# EAGLE schematic haasoscope_pro_adc_fpga_board (EAGLE 9.6.2), part 1 of 3

## Sheet 1 of 16: Preinput 1
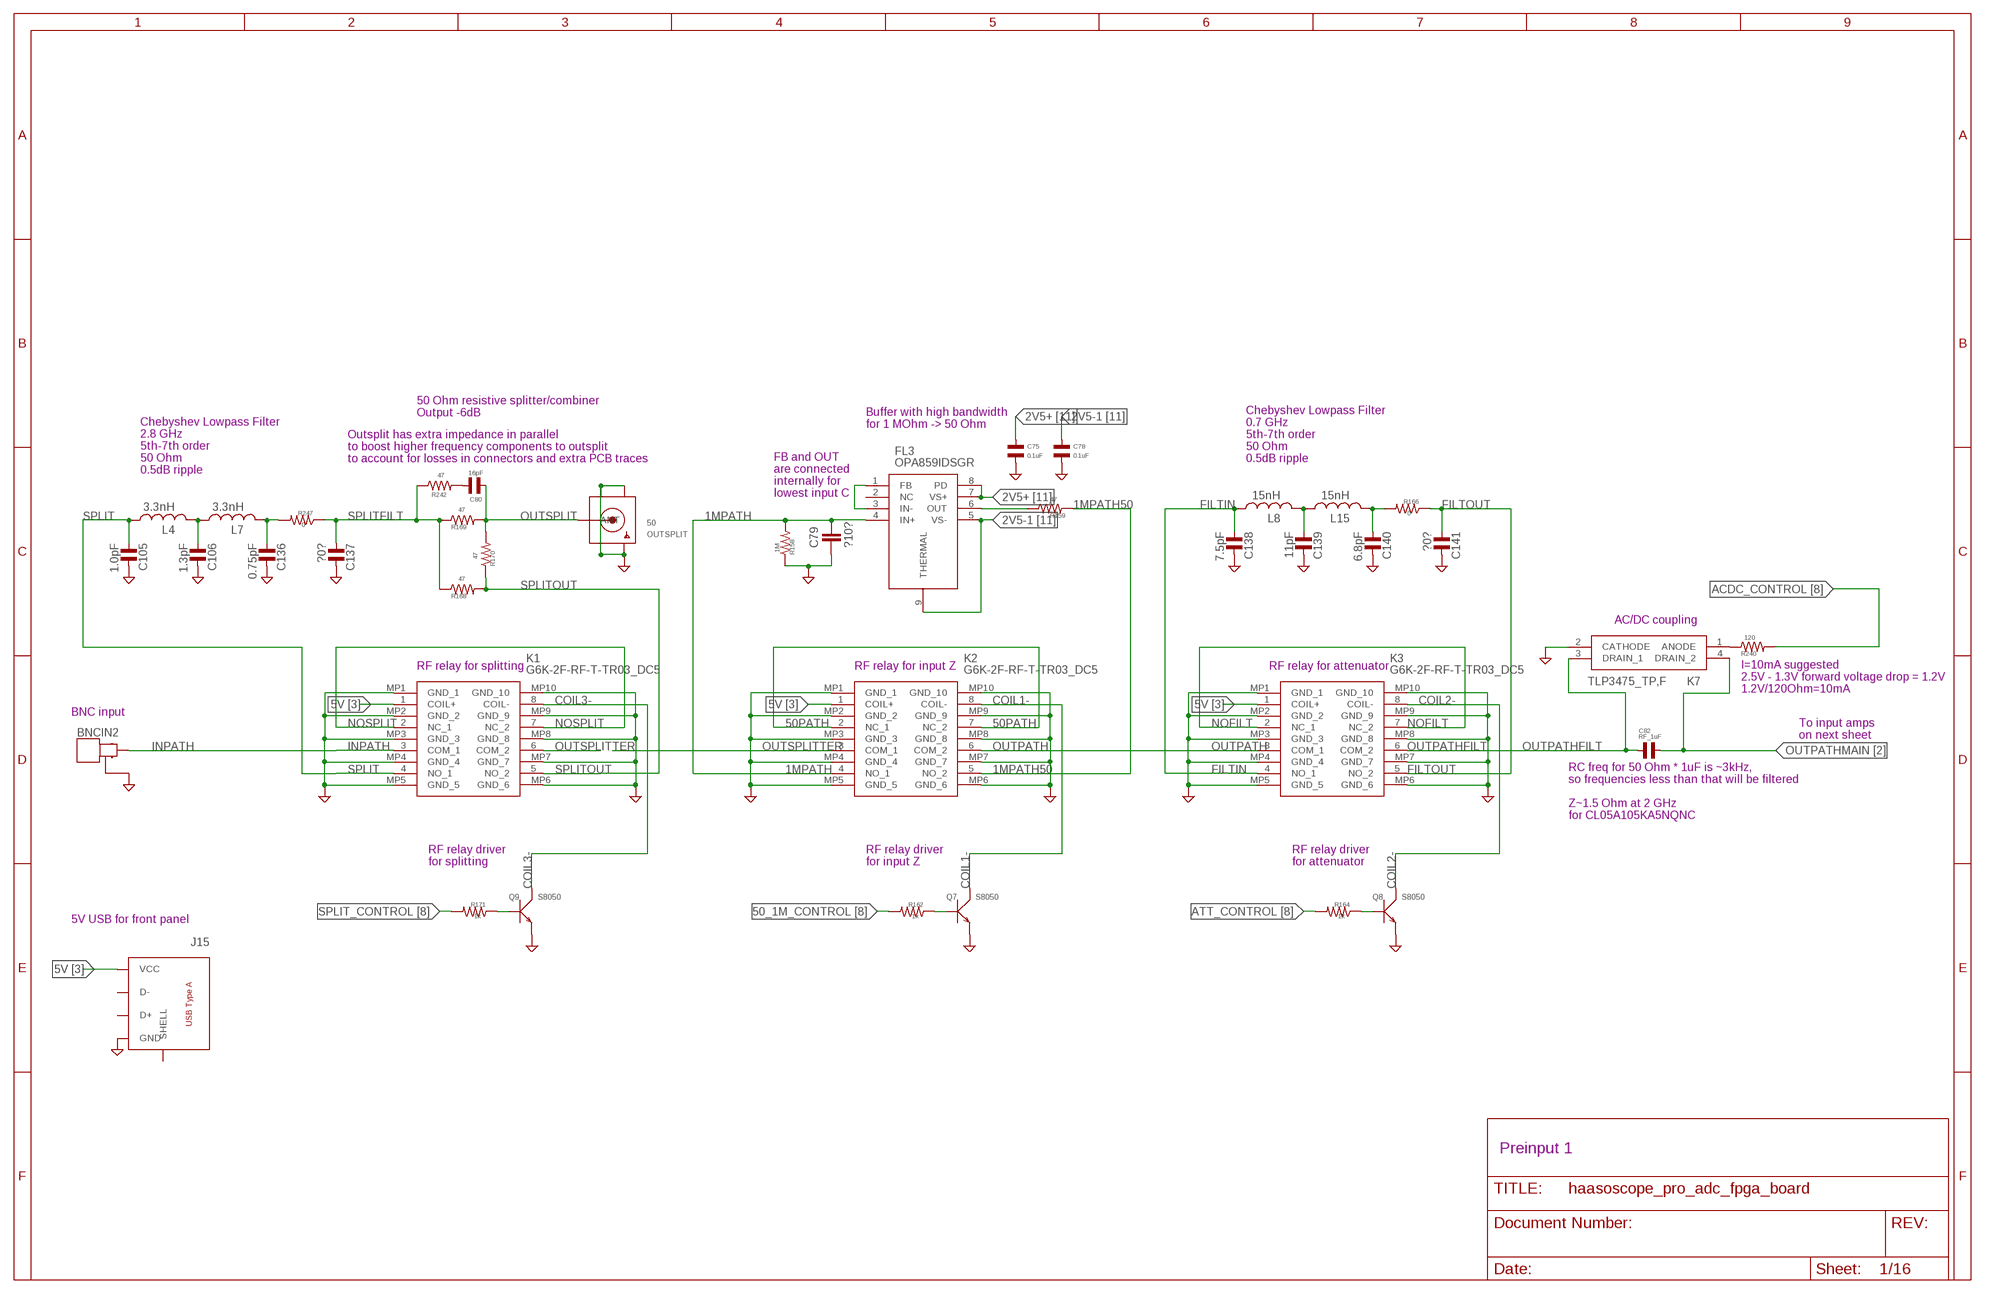
[diagram p0: schematic, sheet 1]

### Parts
BNCIN2  MOLEX_BNC_73100-0105  [MOLEX-BNC-73100-0105]
C75  0.1uF  CAPACITOR_NP_0402  [C0402]
C78  0.1uF  CAPACITOR_NP_0402  [C0402]
C79  ?10?  C-EUC0805  [C0805]
C80  16pF  CAPACITOR_NP_0402  [C0402]
C82  RF_1uF  CAPACITOR_NP_0402  [C0402]
C105  1.0pF  CAPACITOR_NP_0402  [C0402]
C106  1.3pF  CAPACITOR_NP_0402  [C0402]
C136  0.75pF  CAPACITOR_NP_0402  [C0402]
C137  ?0?  CAPACITOR_NP_0402  [C0402]
C138  7.5pF  CAPACITOR_NP_0402  [C0402]
C139  11pF  CAPACITOR_NP_0402  [C0402]
C140  6.8pF  CAPACITOR_NP_0402  [C0402]
C141  ?0?  CAPACITOR_NP_0402  [C0402]
FL3  OPA859IDSGR  [SON50P200X200X80-9N]
J15  test1  USB-TYPE-ATHT-RA  [USB-2.0-A-THT-RA-TE_AMP-292303-1]
K1  G6K-2F-RF-T-TR03_DC5  [G6K2FRFTTR03DC5]
K2  G6K-2F-RF-T-TR03_DC5  [G6K2FRFTTR03DC5]
K3  G6K-2F-RF-T-TR03_DC5  [G6K2FRFTTR03DC5]
K7  TLP3475_TP,F  [TLP3475TPF]
L4  3.3nH  INDUCTOR_0402_N  [RESC0402_N]
L7  3.3nH  INDUCTOR_0402_N  [RESC0402_N]
L8  15nH  INDUCTOR_0402_N  [RESC0402_N]
L15  15nH  INDUCTOR_0402_N  [RESC0402_N]
OUTSPLIT  50  SMACONNECTOR_EDGE  [SMA_EDGELAUNCH]
Q7  S8050  SMD-TRANSISTORS-NPN-25V-500MW-S8050(SOT-23)  [SOT-23]
Q8  S8050  SMD-TRANSISTORS-NPN-25V-500MW-S8050(SOT-23)  [SOT-23]
Q9  S8050  SMD-TRANSISTORS-NPN-25V-500MW-S8050(SOT-23)  [SOT-23]
R158  1M  RESISTOR_0402  [R0402]
R159  47  RESISTOR_0402  [R0402]
R162  1k  RESISTOR_0402  [R0402]
R164  1k  RESISTOR_0402  [R0402]
R166  0  RESISTOR_0402  [R0402]
R168  47  RESISTOR_0402  [R0402]
R169  47  RESISTOR_0402  [R0402]
R170  47  RESISTOR_0402  [R0402]
R171  1k  RESISTOR_0402  [R0402]
R240  120  RESISTOR_0402  [R0402]
R242  47  RESISTOR_0402  [R0402]
R247  0  RESISTOR_0402  [R0402]

### Nets
1MPATH: C79.2 FL3.4(IN+) K2.4(NO_1) R158.P$2
1MPATH50: K2.5(NO_2) R159.P$2
2V5+ [power]: C75.P$1 FL3.7(VS+) FL3.8(PD) ; also sheet 2,3,4,11
2V5-1 [power]: C78.P$1 FL3.5(VS-) FL3.9(THERMAL) ; also sheet 2,11
5V [power]: J15.P$1(VCC) K1.1(COIL+) K2.1(COIL+) K3.1(COIL+) ; also sheet 3,8,9,10,11,12,13,15
50_1M_CONTROL: R162.P$2 ; also sheet 8
50PATH: K2.2(NC_1) K2.7(NC_2)
ACDC_CONTROL: R240.P$2 ; also sheet 8
ATT_CONTROL: R164.P$2 ; also sheet 8
COIL1-: K2.8(COIL-) Q7.3(C)
COIL2-: K3.8(COIL-) Q8.3(C)
COIL3-: K1.8(COIL-) Q9.3(C)
FILTIN: C138.P$1 K3.4(NO_1) L8.1
FILTOUT: C141.P$1 K3.5(NO_2) R166.P$1
GND: BNCIN2.GND1(GND) BNCIN2.GND2(GND) C75.P$2 C78.P$2 C79.1 C105.P$2 C106.P$2 C136.P$2 C137.P$2 C138.P$2 C139.P$2 C140.P$2 C141.P$2 J15.P$4(GND) K1.MP1(GND_1) K1.MP2(GND_2) K1.MP3(GND_3) K1.MP4(GND_4) K1.MP5(GND_5) K1.MP6(GND_6) K1.MP7(GND_7) K1.MP8(GND_8) K1.MP9(GND_9) K1.MP10(GND_10) K2.MP1(GND_1) K2.MP2(GND_2) K2.MP3(GND_3) K2.MP4(GND_4) K2.MP5(GND_5) K2.MP6(GND_6) K2.MP7(GND_7) K2.MP8(GND_8) K2.MP9(GND_9) K2.MP10(GND_10) K3.MP1(GND_1) K3.MP2(GND_2) K3.MP3(GND_3) K3.MP4(GND_4) K3.MP5(GND_5) K3.MP6(GND_6) K3.MP7(GND_7) K3.MP8(GND_8) K3.MP9(GND_9) K3.MP10(GND_10) K7.2(CATHODE) OUTSPLIT.GND@1(GND4) OUTSPLIT.GND@2(GND3) OUTSPLIT.GND@3(GND2) OUTSPLIT.GND@4(GND1) Q7.2(E) Q8.2(E) Q9.2(E) R158.P$1 ; also sheet 2,3,4,5,6,7,8,9,10,11,12,13,14,15
INPATH: BNCIN2.SIGNAL K1.3(COM_1)
N$11: C139.P$1 L8.2 L15.1
N$50: FL3.6(OUT) R159.P$1
N$51: FL3.1(FB) FL3.3(IN-)
N$53: Q7.1(B) R162.P$1
N$55: Q8.1(B) R164.P$1
N$56: Q9.1(B) R171.P$1
N$64: K7.1(ANODE) R240.P$1
N$67: C80.P$1 R242.P$2
N$70: C140.P$1 L15.2 R166.P$2
N$81: C136.P$1 L7.2 R247.P$2
N$82: C106.P$1 L4.2 L7.1
NOFILT: K3.2(NC_1) K3.7(NC_2)
NOSPLIT: K1.2(NC_1) K1.7(NC_2)
OUTPATH: K2.6(COM_2) K3.3(COM_1)
OUTPATHFILT: C82.P$1 K3.6(COM_2) K7.3(DRAIN_1)
OUTPATHMAIN: C82.P$2 K7.4(DRAIN_2) ; also sheet 2
OUTSPLIT [critical]: C80.P$2 OUTSPLIT.P(ANT) R169.P$2 R170.P$2
OUTSPLITTER: K1.6(COM_2) K2.3(COM_1)
SPLIT: C105.P$1 K1.4(NO_1) L4.1
SPLIT_CONTROL: R171.P$2 ; also sheet 8
SPLITFILT: C137.P$1 R168.P$1 R169.P$1 R242.P$1 R247.P$1
SPLITOUT: K1.5(NO_2) R168.P$2 R170.P$1
Unconnected: FL3.2(NC) J15.P$2(D-) J15.P$3(D+) J15.S$1(SHELL) J15.S$2(SHELL)

### Notes on the sheet
- 50 Ohm resistive splitter/combiner
  Output -6dB
- Buffer with high bandwidth
  for 1 MOhm -> 50 Ohm
- Outsplit has extra impedance in parallel
  to boost higher frequency components to outsplit
  to account for losses in connectors and extra PCB traces
- Chebyshev Lowpass Filter
  0.7 GHz
  5th-7th order
  50 Ohm
  0.5dB ripple
- Chebyshev Lowpass Filter
  2.8 GHz
  5th-7th order
  50 Ohm
  0.5dB ripple
- FB and OUT
  are connected
  internally for
  lowest input C
- AC/DC coupling
- RF relay for splitting | RF relay for input Z | RF relay for attenuator
- I=10mA suggested
  2.5V - 1.3V forward voltage drop = 1.2V
  1.2V/120Ohm=10mA
- BNC input
- To input amps
  on next sheet
- RC freq for 50 Ohm * 1uF is ~3kHz,
  so frequencies less than that will be filtered
  
  Z~1.5 Ohm at 2 GHz
  for CL05A105KA5NQNC
- RF relay driver
  for splitting
- RF relay driver
  for input Z
- RF relay driver
  for attenuator
- 5V USB for front panel
- Preinput 1

## Sheet 2 of 16: Input amps 1
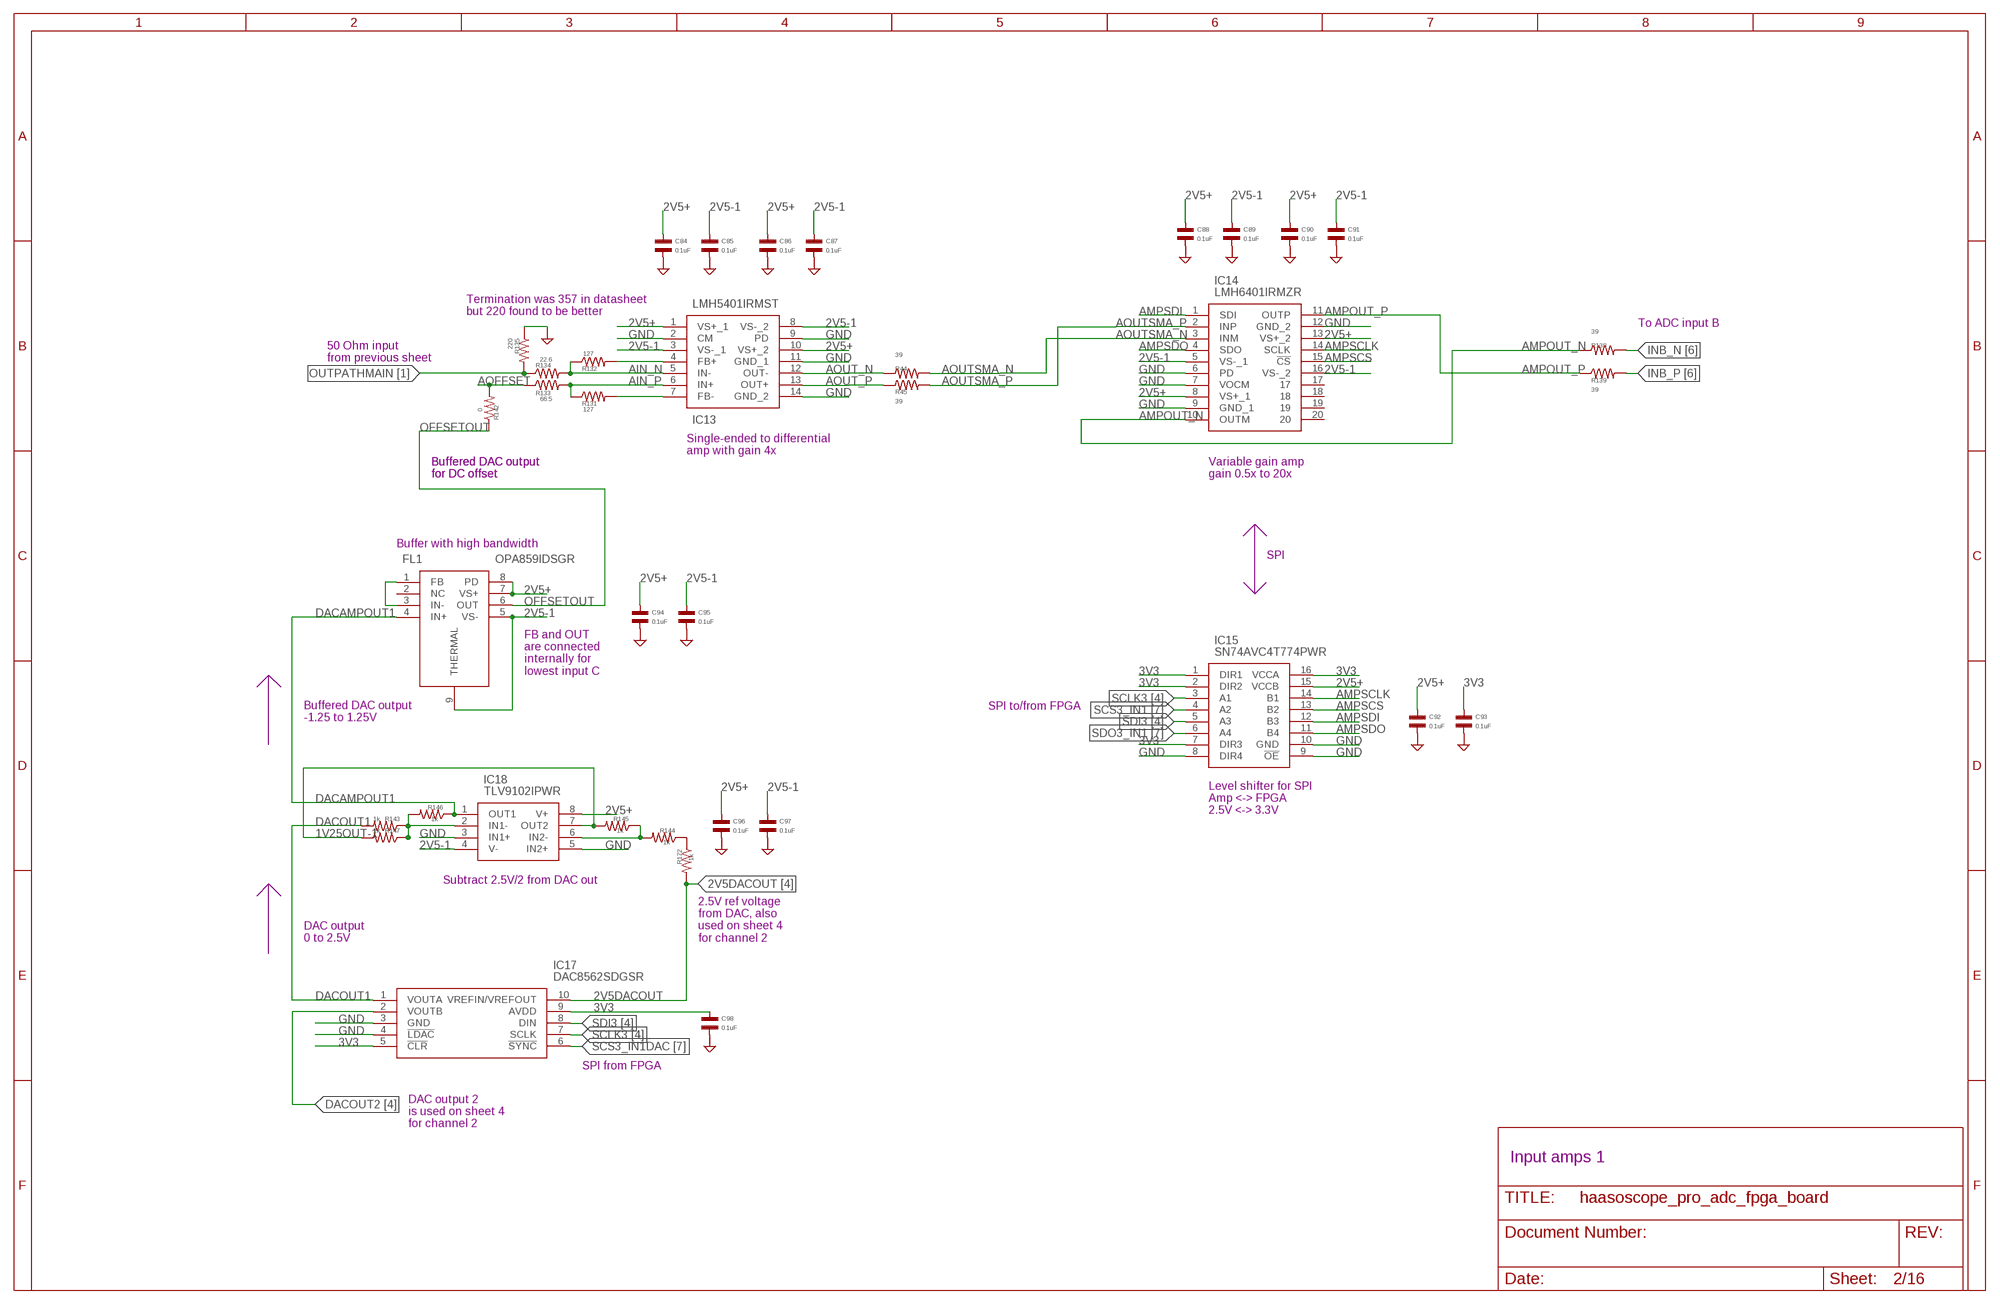
[diagram p1: schematic, sheet 2]

### Parts
C84  0.1uF  CAPACITOR_NP_0402  [C0402]
C85  0.1uF  CAPACITOR_NP_0402  [C0402]
C86  0.1uF  CAPACITOR_NP_0402  [C0402]
C87  0.1uF  CAPACITOR_NP_0402  [C0402]
C88  0.1uF  CAPACITOR_NP_0402  [C0402]
C89  0.1uF  CAPACITOR_NP_0402  [C0402]
C90  0.1uF  CAPACITOR_NP_0402  [C0402]
C91  0.1uF  CAPACITOR_NP_0402  [C0402]
C92  0.1uF  CAPACITOR_NP_0402  [C0402]
C93  0.1uF  CAPACITOR_NP_0402  [C0402]
C94  0.1uF  CAPACITOR_NP_0402  [C0402]
C95  0.1uF  CAPACITOR_NP_0402  [C0402]
C96  0.1uF  CAPACITOR_NP_0402  [C0402]
C97  0.1uF  CAPACITOR_NP_0402  [C0402]
C98  0.1uF  CAPACITOR_NP_0402  [C0402]
FL1  OPA859IDSGR  [SON50P200X200X80-9N]
IC13  LMH5401IRMST  [LMH5401IRMSR]
IC14  LMH6401IRMZR  [LMH6401IRMZR]
IC15  SN74AVC4T774PWR  [SOP65P640X120-16N]
IC17  DAC8562SDGSR  [SOP50P490X110-10N]
IC18  TLV9102IPWR  [SOP65P640X120-8N]
R44  39  RESISTOR_0402  [R0402]
R45  39  RESISTOR_0402  [R0402]
R131  127  RESISTOR_0402  [R0402]
R132  127  RESISTOR_0402  [R0402]
R133  66.5  RESISTOR_0402  [R0402]
R134  22.6  RESISTOR_0402  [R0402]
R135  220  RESISTOR_0402  [R0402]
R138  39  RESISTOR_0402  [R0402]
R139  39  RESISTOR_0402  [R0402]
R142  0  RESISTOR_0402  [R0402]
R143  1k  RESISTOR_0402  [R0402]
R144  1k  RESISTOR_0402  [R0402]
R145  1k  RESISTOR_0402  [R0402]
R146  1k  RESISTOR_0402  [R0402]
R147  1k  RESISTOR_0402  [R0402]
R172  1k  RESISTOR_0402  [R0402]

### Nets
1V25OUT-1: IC18.7(OUT2) R145.P$2 R147.P$2
2V5+ [power]: C84.P$1 C86.P$1 C88.P$1 C90.P$1 C92.P$1 C94.P$1 C96.P$1 FL1.7(VS+) FL1.8(PD) IC13.1(VS+_1) IC13.10(VS+_2) IC14.8(VS+_1) IC14.13(VS+_2) IC15.15(VCCB) IC18.8(V+) ; also sheet 1,3,4,11
2V5-1 [power]: C85.P$1 C87.P$1 C89.P$1 C91.P$1 C95.P$1 C97.P$1 FL1.5(VS-) FL1.9(THERMAL) IC13.3(VS-_1) IC13.8(VS-_2) IC14.5(VS-_1) IC14.16(VS-_2) IC18.4(V-) ; also sheet 1,11
2V5DACOUT: IC17.10(VREFIN/VREFOUT) R172.P$2 ; also sheet 4
3V3 [power]: C93.P$1 C98.P$1 IC15.1(DIR1) IC15.2(DIR2) IC15.7(DIR3) IC15.16(VCCA) IC17.5(!CLR) IC17.9(AVDD) ; also sheet 4,5,8,9,11,13,14,15
AIN_N [loosediffpair]: IC13.5(IN-) R132.P$1 R134.P$2
AIN_P [loosediffpair]: IC13.6(IN+) R131.P$1 R133.P$2
AMPOUT_N [loosediffpair]: IC14.10(OUTM) R138.P$1
AMPOUT_P [loosediffpair]: IC14.11(OUTP) R139.P$1
AMPSCLK: IC14.14(SCLK) IC15.14(B1)
AMPSCS: IC14.15(!CS) IC15.13(B2)
AMPSDI: IC14.1(SDI) IC15.12(B3)
AMPSDO: IC14.4(SDO) IC15.11(B4)
AOFFSET: R133.P$1 R142.P$2
AOUT_N [loosediffpair]: IC13.12(OUT-) R44.P$1
AOUT_P [loosediffpair]: IC13.13(OUT+) R45.P$1
AOUTSMA_N [loosediffpair]: IC14.3(INM) R44.P$2
AOUTSMA_P [loosediffpair]: IC14.2(INP) R45.P$2
DACAMPOUT1: FL1.4(IN+) IC18.1(OUT1) R146.P$1
DACOUT1: IC17.1(VOUTA) R143.P$2
DACOUT2: IC17.2(VOUTB) ; also sheet 4
GND: C84.P$2 C85.P$2 C86.P$2 C87.P$2 C88.P$2 C89.P$2 C90.P$2 C91.P$2 C92.P$2 C93.P$2 C94.P$2 C95.P$2 C96.P$2 C97.P$2 C98.P$2 IC13.2(CM) IC13.9(PD) IC13.11(GND_1) IC13.14(GND_2) IC14.6(PD) IC14.7(VOCM) IC14.9(GND_1) IC14.12(GND_2) IC15.8(DIR4) IC15.9(!OE) IC15.10(GND) IC17.3(GND) IC17.4(!LDAC) IC18.3(IN1+) IC18.5(IN2+) R135.P$1 ; also sheet 1,3,4,5,6,7,8,9,10,11,12,13,14,15
INB_N [looserdiffpair]: R138.P$2 ; also sheet 6
INB_P [looserdiffpair]: R139.P$2 ; also sheet 6
N$2: FL1.1(FB) FL1.3(IN-)
N$8: IC13.7(FB-) R131.P$2
N$9: IC13.4(FB+) R132.P$2
N$15: IC18.6(IN2-) R144.P$2 R145.P$1
N$16: IC18.2(IN1-) R143.P$1 R146.P$2 R147.P$1
N$39: R144.P$1 R172.P$1
OFFSETOUT: FL1.6(OUT) R142.P$1
OUTPATHMAIN: R134.P$1 R135.P$2 ; also sheet 1
SCLK3: IC15.3(A1) IC17.7(SCLK) ; also sheet 4,5,6,7,15
SCS3_IN1: IC15.4(A2) ; also sheet 7
SCS3_IN1DAC: IC17.6(!SYNC) ; also sheet 7
SDI3: IC15.5(A3) IC17.8(DIN) ; also sheet 4,5,6,7,15
SDO3_IN1: IC15.6(A4) ; also sheet 7
Unconnected: FL1.2(NC) IC14.17 IC14.18 IC14.19 IC14.20

### Notes on the sheet
- Termination was 357 in datasheet
  but 220 found to be better
- To ADC input B
- 50 Ohm input
  from previous sheet
- Single-ended to differential
  amp with gain 4x
- Buffered DAC output
  for DC offset
- Buffered DAC output
  for DC offset
- Variable gain amp
  gain 0.5x to 20x
- Buffer with high bandwidth
- SPI
- FB and OUT
  are connected
  internally for
  lowest input C
- SPI to/from FPGA
- Buffered DAC output
  -1.25 to 1.25V
- Level shifter for SPI
  Amp <-> FPGA
  2.5V <-> 3.3V
- Subtract 2.5V/2 from DAC out
- DAC output
  0 to 2.5V
- 2.5V ref voltage
  from DAC, also
  used on sheet 4
  for channel 2
- SPI from FPGA
- DAC output 2
  is used on sheet 4
  for channel 2
- Input amps 1

## Sheet 3 of 16: Preinput 2
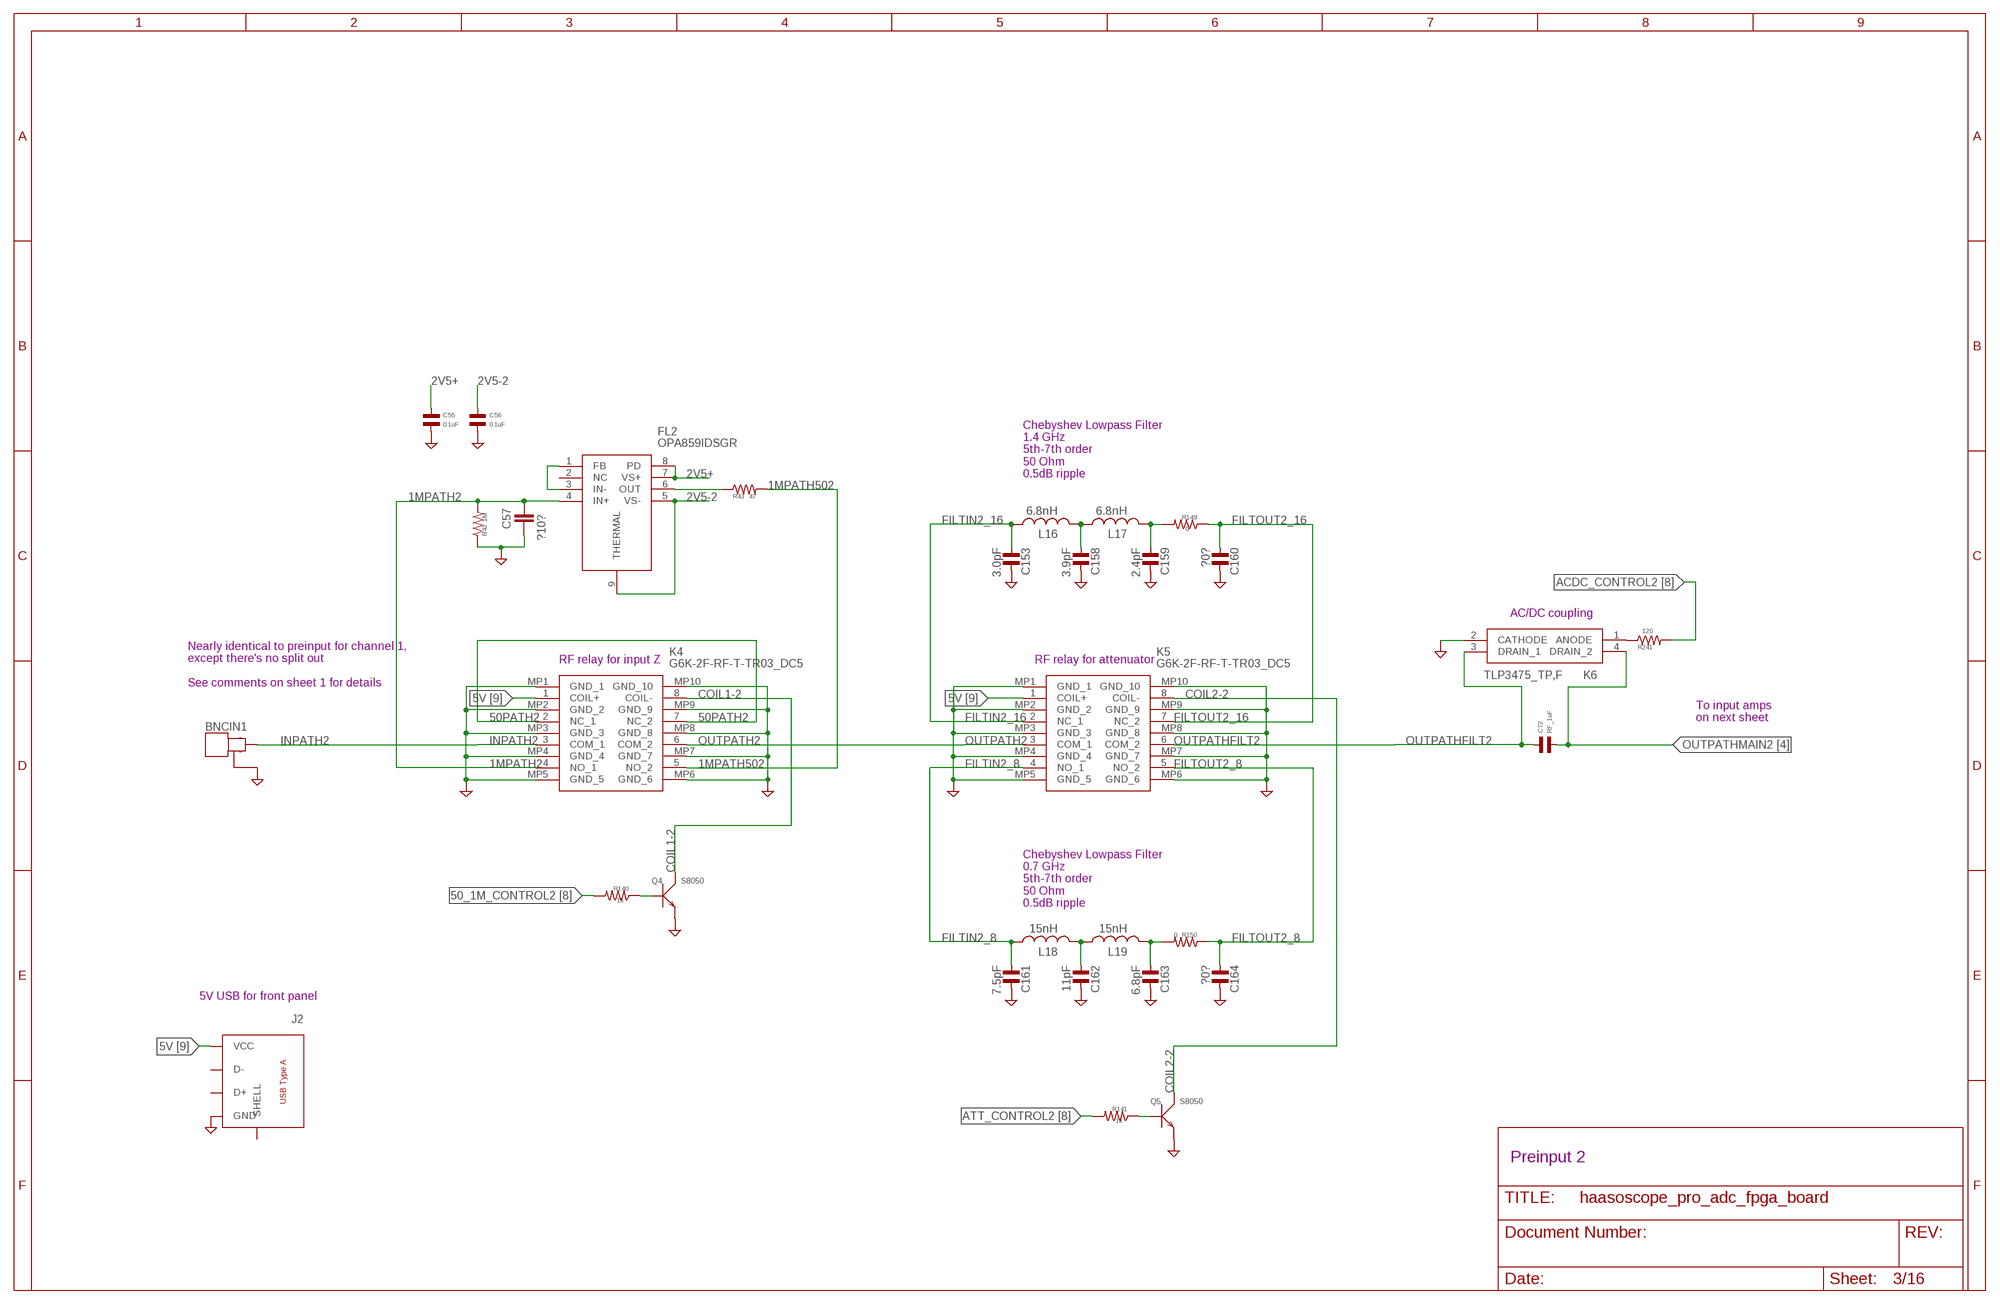
[diagram p2: schematic, sheet 3]

### Parts
BNCIN1  MOLEX_BNC_73100-0105  [MOLEX-BNC-73100-0105]
C55  0.1uF  CAPACITOR_NP_0402  [C0402]
C56  0.1uF  CAPACITOR_NP_0402  [C0402]
C57  ?10?  C-EUC0805  [C0805]
C72  RF_1uF  CAPACITOR_NP_0402  [C0402]
C153  3.0pF  CAPACITOR_NP_0402  [C0402]
C158  3.9pF  CAPACITOR_NP_0402  [C0402]
C159  2.4pF  CAPACITOR_NP_0402  [C0402]
C160  ?0?  CAPACITOR_NP_0402  [C0402]
C161  7.5pF  CAPACITOR_NP_0402  [C0402]
C162  11pF  CAPACITOR_NP_0402  [C0402]
C163  6.8pF  CAPACITOR_NP_0402  [C0402]
C164  ?0?  CAPACITOR_NP_0402  [C0402]
FL2  OPA859IDSGR  [SON50P200X200X80-9N]
J2  test1  USB-TYPE-ATHT-RA  [USB-2.0-A-THT-RA-TE_AMP-292303-1]
K4  G6K-2F-RF-T-TR03_DC5  [G6K2FRFTTR03DC5]
K5  G6K-2F-RF-T-TR03_DC5  [G6K2FRFTTR03DC5]
K6  TLP3475_TP,F  [TLP3475TPF]
L16  6.8nH  INDUCTOR_0402_N  [RESC0402_N]
L17  6.8nH  INDUCTOR_0402_N  [RESC0402_N]
L18  15nH  INDUCTOR_0402_N  [RESC0402_N]
L19  15nH  INDUCTOR_0402_N  [RESC0402_N]
Q4  S8050  SMD-TRANSISTORS-NPN-25V-500MW-S8050(SOT-23)  [SOT-23]
Q5  S8050  SMD-TRANSISTORS-NPN-25V-500MW-S8050(SOT-23)  [SOT-23]
R42  1M  RESISTOR_0402  [R0402]
R43  47  RESISTOR_0402  [R0402]
R140  1k  RESISTOR_0402  [R0402]
R141  1k  RESISTOR_0402  [R0402]
R149  0  RESISTOR_0402  [R0402]
R150  0  RESISTOR_0402  [R0402]
R241  120  RESISTOR_0402  [R0402]

### Nets
1MPATH2: C57.2 FL2.4(IN+) K4.4(NO_1) R42.P$2
1MPATH502: K4.5(NO_2) R43.P$2
2V5+ [power]: C55.P$1 FL2.7(VS+) FL2.8(PD) ; also sheet 1,2,4,11
2V5-2 [power]: C56.P$1 FL2.5(VS-) FL2.9(THERMAL) ; also sheet 4,11
5V [power]: J2.P$1(VCC) K4.1(COIL+) K5.1(COIL+) ; also sheet 1,8,9,10,11,12,13,15
50_1M_CONTROL2: R140.P$2 ; also sheet 8
50PATH2: K4.2(NC_1) K4.7(NC_2)
ACDC_CONTROL2: R241.P$2 ; also sheet 8
ATT_CONTROL2: R141.P$2 ; also sheet 8
COIL1-2: K4.8(COIL-) Q4.3(C)
COIL2-2: K5.8(COIL-) Q5.3(C)
FILTIN2_8: C161.P$1 K5.4(NO_1) L18.1
FILTIN2_16: C153.P$1 K5.2(NC_1) L16.1
FILTOUT2_8: C164.P$1 K5.5(NO_2) R150.P$1
FILTOUT2_16: C160.P$1 K5.7(NC_2) R149.P$1
GND: BNCIN1.GND1(GND) BNCIN1.GND2(GND) C55.P$2 C56.P$2 C57.1 C153.P$2 C158.P$2 C159.P$2 C160.P$2 C161.P$2 C162.P$2 C163.P$2 C164.P$2 J2.P$4(GND) K4.MP1(GND_1) K4.MP2(GND_2) K4.MP3(GND_3) K4.MP4(GND_4) K4.MP5(GND_5) K4.MP6(GND_6) K4.MP7(GND_7) K4.MP8(GND_8) K4.MP9(GND_9) K4.MP10(GND_10) K5.MP1(GND_1) K5.MP2(GND_2) K5.MP3(GND_3) K5.MP4(GND_4) K5.MP5(GND_5) K5.MP6(GND_6) K5.MP7(GND_7) K5.MP8(GND_8) K5.MP9(GND_9) K5.MP10(GND_10) K6.2(CATHODE) Q4.2(E) Q5.2(E) R42.P$1 ; also sheet 1,2,4,5,6,7,8,9,10,11,12,13,14,15
INPATH2: BNCIN1.SIGNAL K4.3(COM_1)
N$7: FL2.6(OUT) R43.P$1
N$12: FL2.1(FB) FL2.3(IN-)
N$14: Q4.1(B) R140.P$1
N$18: Q5.1(B) R141.P$1
N$66: K6.1(ANODE) R241.P$1
N$73: C158.P$1 L16.2 L17.1
N$83: C159.P$1 L17.2 R149.P$2
N$88: C162.P$1 L18.2 L19.1
N$89: C163.P$1 L19.2 R150.P$2
OUTPATH2: K4.6(COM_2) K5.3(COM_1)
OUTPATHFILT2: C72.P$1 K5.6(COM_2) K6.3(DRAIN_1)
OUTPATHMAIN2: C72.P$2 K6.4(DRAIN_2) ; also sheet 4
Unconnected: FL2.2(NC) J2.P$2(D-) J2.P$3(D+) J2.S$1(SHELL) J2.S$2(SHELL)

### Notes on the sheet
- Chebyshev Lowpass Filter
  1.4 GHz
  5th-7th order
  50 Ohm
  0.5dB ripple
- AC/DC coupling
- RF relay for input Z | RF relay for attenuator
- Nearly identical to preinput for channel 1,
  except there's no split out
  
  See comments on sheet 1 for details
- To input amps
  on next sheet
- Chebyshev Lowpass Filter
  0.7 GHz
  5th-7th order
  50 Ohm
  0.5dB ripple
- 5V USB for front panel
- Preinput 2

## Sheet 4 of 16: Input amps 2
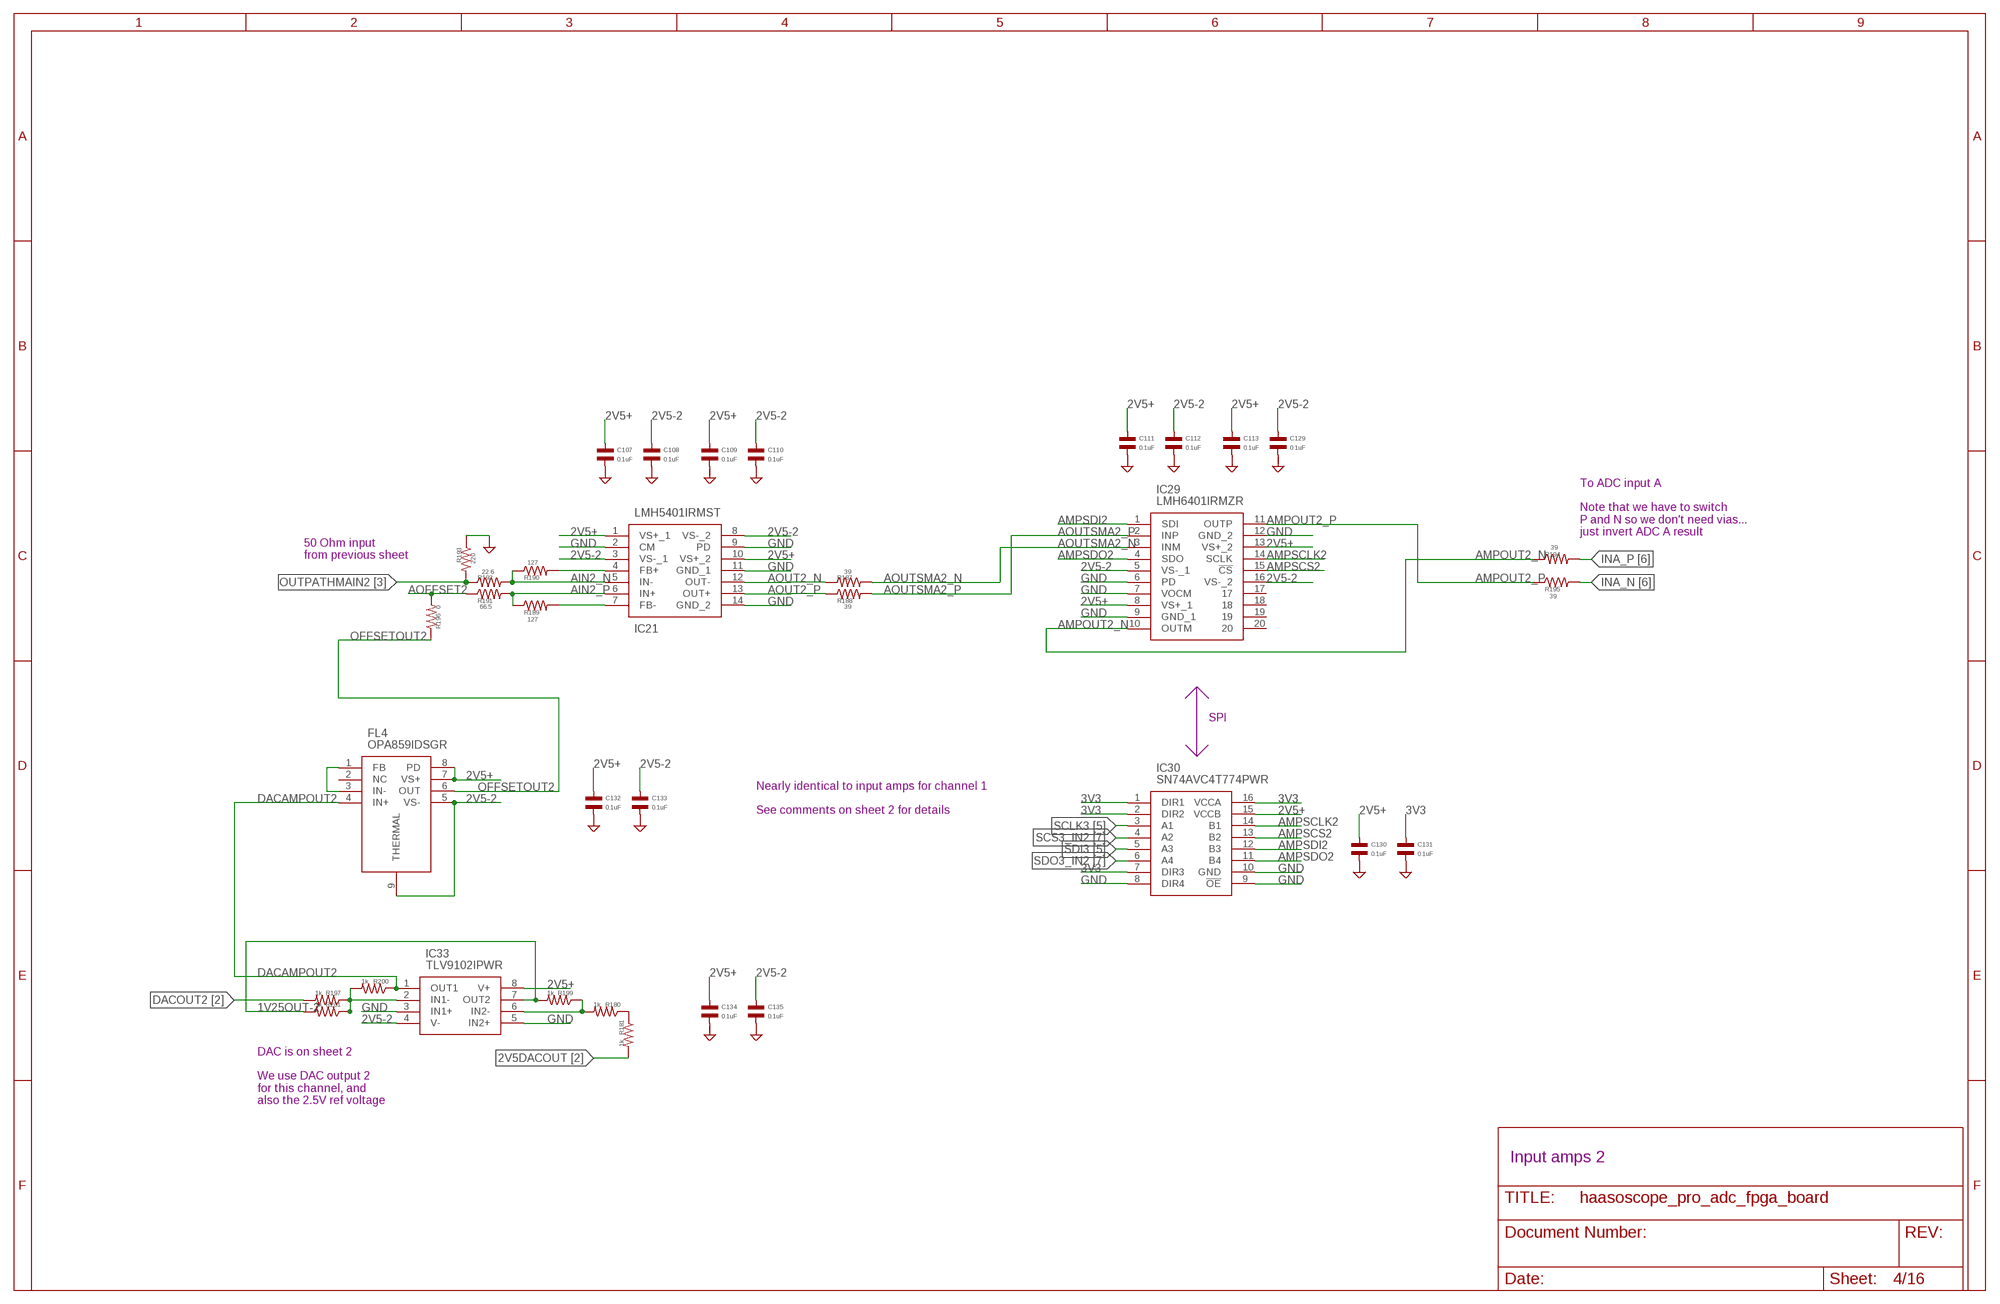
[diagram p3: schematic, sheet 4]

### Parts
C107  0.1uF  CAPACITOR_NP_0402  [C0402]
C108  0.1uF  CAPACITOR_NP_0402  [C0402]
C109  0.1uF  CAPACITOR_NP_0402  [C0402]
C110  0.1uF  CAPACITOR_NP_0402  [C0402]
C111  0.1uF  CAPACITOR_NP_0402  [C0402]
C112  0.1uF  CAPACITOR_NP_0402  [C0402]
C113  0.1uF  CAPACITOR_NP_0402  [C0402]
C129  0.1uF  CAPACITOR_NP_0402  [C0402]
C130  0.1uF  CAPACITOR_NP_0402  [C0402]
C131  0.1uF  CAPACITOR_NP_0402  [C0402]
C132  0.1uF  CAPACITOR_NP_0402  [C0402]
C133  0.1uF  CAPACITOR_NP_0402  [C0402]
C134  0.1uF  CAPACITOR_NP_0402  [C0402]
C135  0.1uF  CAPACITOR_NP_0402  [C0402]
FL4  OPA859IDSGR  [SON50P200X200X80-9N]
IC21  LMH5401IRMST  [LMH5401IRMSR]
IC29  LMH6401IRMZR  [LMH6401IRMZR]
IC30  SN74AVC4T774PWR  [SOP65P640X120-16N]
IC33  TLV9102IPWR  [SOP65P640X120-8N]
R180  1k  RESISTOR_0402  [R0402]
R181  1k  RESISTOR_0402  [R0402]
R187  39  RESISTOR_0402  [R0402]
R188  39  RESISTOR_0402  [R0402]
R189  127  RESISTOR_0402  [R0402]
R190  127  RESISTOR_0402  [R0402]
R191  66.5  RESISTOR_0402  [R0402]
R192  22.6  RESISTOR_0402  [R0402]
R193  220  RESISTOR_0402  [R0402]
R194  39  RESISTOR_0402  [R0402]
R195  39  RESISTOR_0402  [R0402]
R196  0  RESISTOR_0402  [R0402]
R197  1k  RESISTOR_0402  [R0402]
R199  1k  RESISTOR_0402  [R0402]
R200  1k  RESISTOR_0402  [R0402]
R201  1k  RESISTOR_0402  [R0402]

### Nets
1V25OUT-2: IC33.7(OUT2) R199.P$2 R201.P$2
2V5+ [power]: C107.P$1 C109.P$1 C111.P$1 C113.P$1 C130.P$1 C132.P$1 C134.P$1 FL4.7(VS+) FL4.8(PD) IC21.1(VS+_1) IC21.10(VS+_2) IC29.8(VS+_1) IC29.13(VS+_2) IC30.15(VCCB) IC33.8(V+) ; also sheet 1,2,3,11
2V5-2 [power]: C108.P$1 C110.P$1 C112.P$1 C129.P$1 C133.P$1 C135.P$1 FL4.5(VS-) FL4.9(THERMAL) IC21.3(VS-_1) IC21.8(VS-_2) IC29.5(VS-_1) IC29.16(VS-_2) IC33.4(V-) ; also sheet 3,11
2V5DACOUT: R181.P$2 ; also sheet 2
3V3 [power]: C131.P$1 IC30.1(DIR1) IC30.2(DIR2) IC30.7(DIR3) IC30.16(VCCA) ; also sheet 2,5,8,9,11,13,14,15
AIN2_N [loosediffpair]: IC21.5(IN-) R190.P$1 R192.P$2
AIN2_P [loosediffpair]: IC21.6(IN+) R189.P$1 R191.P$2
AMPOUT2_N [loosediffpair]: IC29.10(OUTM) R194.P$1
AMPOUT2_P [loosediffpair]: IC29.11(OUTP) R195.P$1
AMPSCLK2: IC29.14(SCLK) IC30.14(B1)
AMPSCS2: IC29.15(!CS) IC30.13(B2)
AMPSDI2: IC29.1(SDI) IC30.12(B3)
AMPSDO2: IC29.4(SDO) IC30.11(B4)
AOFFSET2: R191.P$1 R196.P$2
AOUT2_N [loosediffpair]: IC21.12(OUT-) R187.P$1
AOUT2_P [loosediffpair]: IC21.13(OUT+) R188.P$1
AOUTSMA2_N [loosediffpair]: IC29.3(INM) R187.P$2
AOUTSMA2_P [loosediffpair]: IC29.2(INP) R188.P$2
DACAMPOUT2: FL4.4(IN+) IC33.1(OUT1) R200.P$1
DACOUT2: R197.P$2 ; also sheet 2
GND: C107.P$2 C108.P$2 C109.P$2 C110.P$2 C111.P$2 C112.P$2 C113.P$2 C129.P$2 C130.P$2 C131.P$2 C132.P$2 C133.P$2 C134.P$2 C135.P$2 IC21.2(CM) IC21.9(PD) IC21.11(GND_1) IC21.14(GND_2) IC29.6(PD) IC29.7(VOCM) IC29.9(GND_1) IC29.12(GND_2) IC30.8(DIR4) IC30.9(!OE) IC30.10(GND) IC33.3(IN1+) IC33.5(IN2+) R193.P$1 ; also sheet 1,2,3,5,6,7,8,9,10,11,12,13,14,15
INA_N [looserdiffpair]: R195.P$2 ; also sheet 6
INA_P [looserdiffpair]: R194.P$2 ; also sheet 6
N$1: FL4.1(FB) FL4.3(IN-)
N$5: IC21.7(FB-) R189.P$2
N$6: IC21.4(FB+) R190.P$2
N$22: IC33.6(IN2-) R180.P$2 R199.P$1
N$33: IC33.2(IN1-) R197.P$1 R200.P$2 R201.P$1
N$40: R180.P$1 R181.P$1
OFFSETOUT2: FL4.6(OUT) R196.P$1
OUTPATHMAIN2: R192.P$1 R193.P$2 ; also sheet 3
SCLK3: IC30.3(A1) ; also sheet 2,5,6,7,15
SCS3_IN2: IC30.4(A2) ; also sheet 7
SDI3: IC30.5(A3) ; also sheet 2,5,6,7,15
SDO3_IN2: IC30.6(A4) ; also sheet 7
Unconnected: FL4.2(NC) IC29.17 IC29.18 IC29.19 IC29.20

### Notes on the sheet
- To ADC input A
  
  Note that we have to switch
  P and N so we don't need vias...
  just invert ADC A result
- 50 Ohm input
  from previous sheet
- SPI
- Nearly identical to input amps for channel 1
  
  See comments on sheet 2 for details
- DAC is on sheet 2
  
  We use DAC output 2
  for this channel, and
  also the 2.5V ref voltage
- Input amps 2

## Sheet 5 of 16: Clock
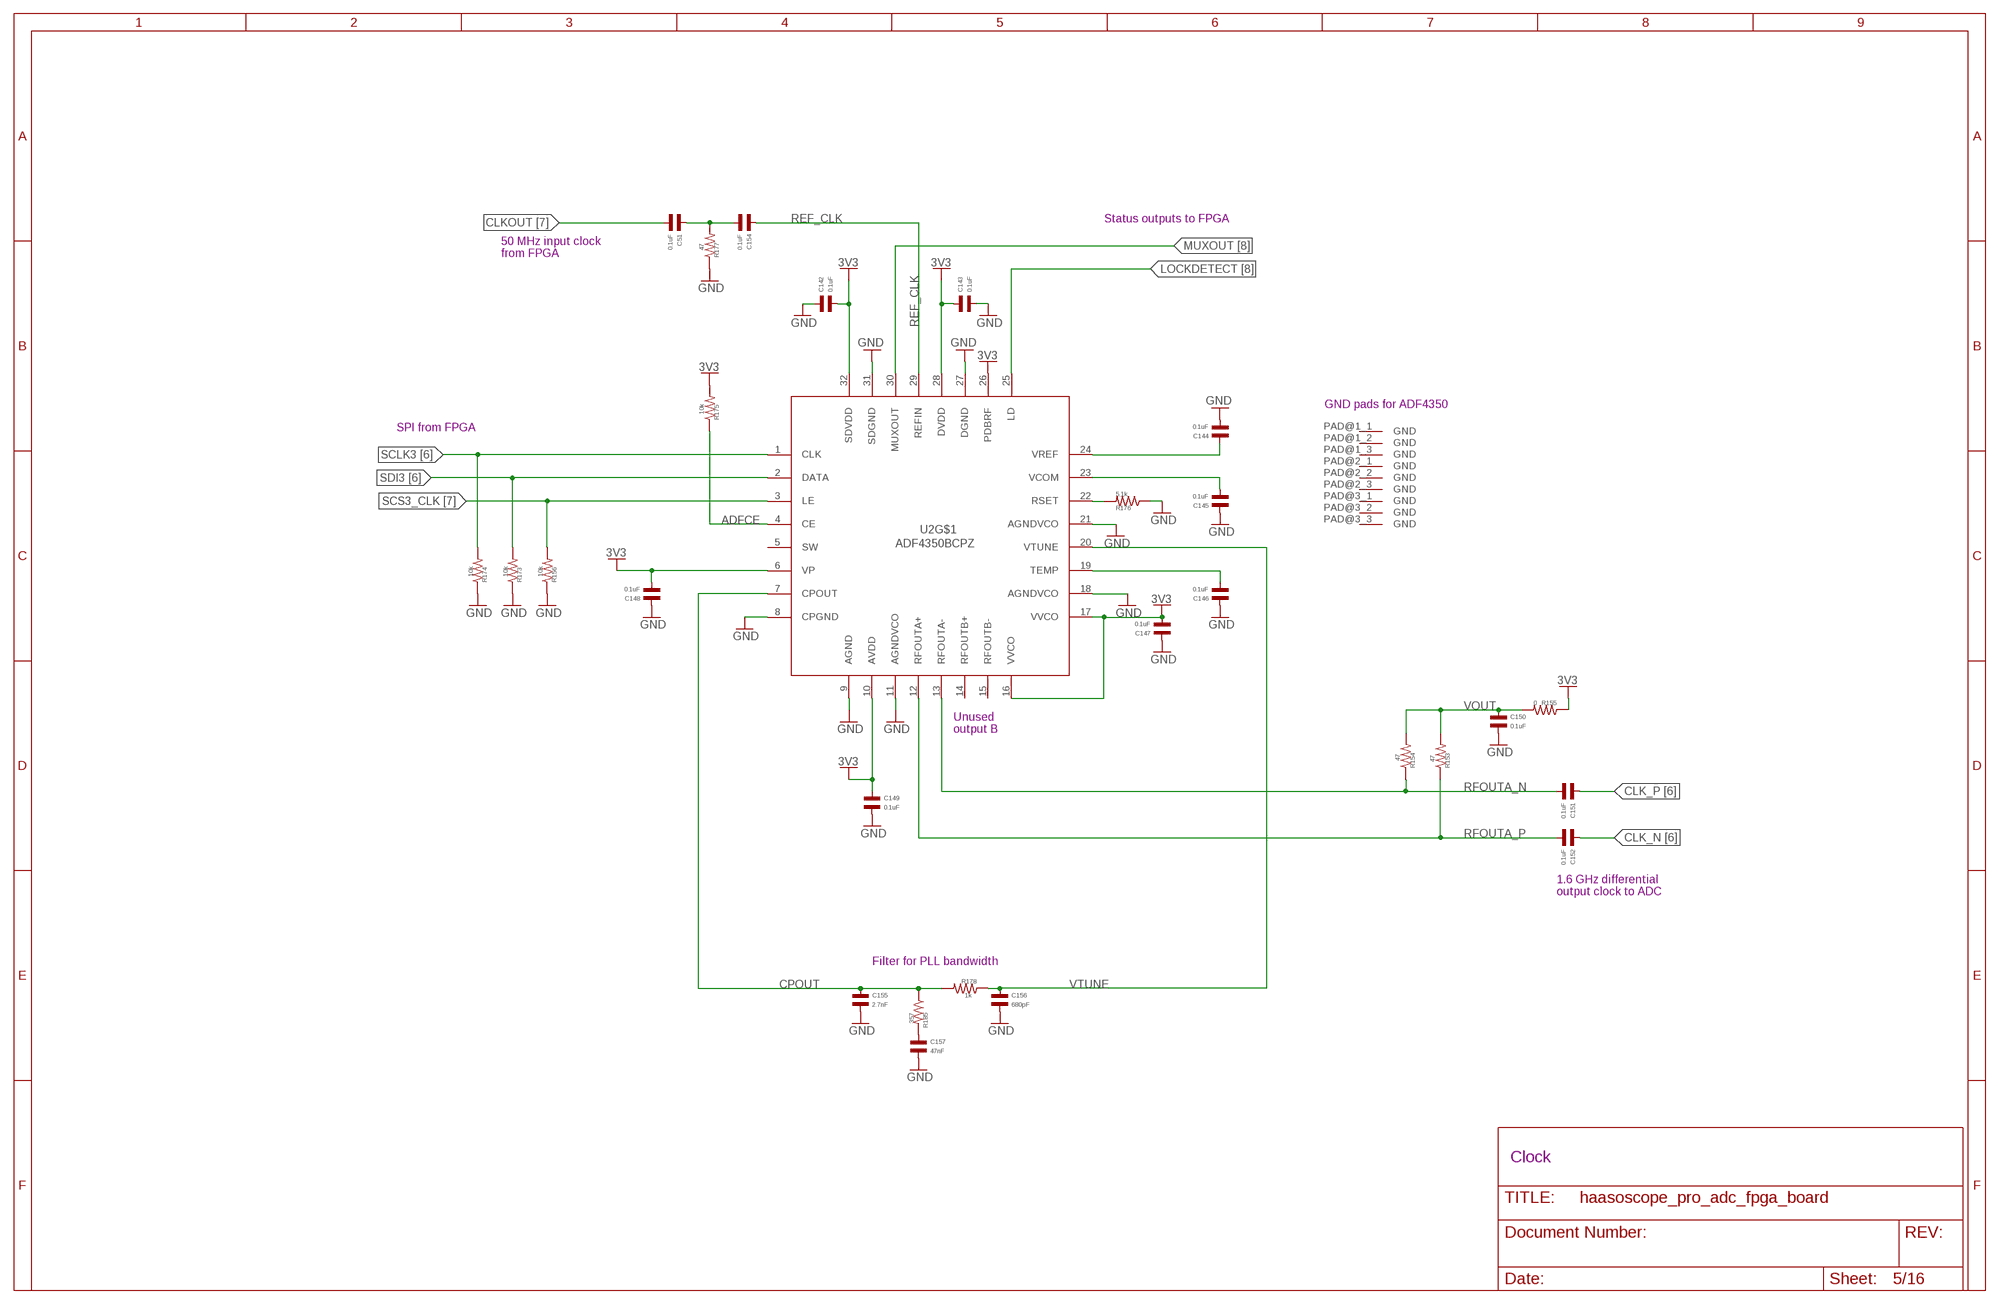
[diagram p4: schematic, sheet 5]

### Parts
C51  0.1uF  CAPACITOR_NP_0402  [C0402]
C142  0.1uF  CAPACITOR_NP_0402  [C0402]
C143  0.1uF  CAPACITOR_NP_0402  [C0402]
C144  0.1uF  CAPACITOR_NP_0402  [C0402]
C145  0.1uF  CAPACITOR_NP_0402  [C0402]
C146  0.1uF  CAPACITOR_NP_0402  [C0402]
C147  0.1uF  CAPACITOR_NP_0402  [C0402]
C148  0.1uF  CAPACITOR_NP_0402  [C0402]
C149  0.1uF  CAPACITOR_NP_0402  [C0402]
C150  0.1uF  CAPACITOR_NP_0402  [C0402]
C151  0.1uF  CAPACITOR_NP_0402  [C0402]
C152  0.1uF  CAPACITOR_NP_0402  [C0402]
C154  0.1uF  CAPACITOR_NP_0402  [C0402]
C155  2.7nF  CAPACITOR_NP_0402  [C0402]
C156  680pF  CAPACITOR_NP_0402  [C0402]
C157  47nF  CAPACITOR_NP_0402  [C0402]
R153  47  RESISTOR_0402  [R0402]
R154  47  RESISTOR_0402  [R0402]
R155  0  RESISTOR_0402  [R0402]
R156  10k  RESISTOR_0402  [R0402]
R173  10k  RESISTOR_0402  [R0402]
R174  10k  RESISTOR_0402  [R0402]
R175  10k  RESISTOR_0402  [R0402]
R176  5.1k  RESISTOR_0402  [R0402]
R177  47  RESISTOR_0402  [R0402]
R178  1k  RESISTOR_0402  [R0402]
R185  357  RESISTOR_0402  [R0402]
U2  ADF4350BCPZ  [QFN50P500X500X100-33V2N]

### Nets
3V3 [power]: C142.P$2 C143.P$1 C147.P$2 C148.P$2 C149.P$1 R155.P$1 R175.P$2 U2.6(VP) U2.10(AVDD) U2.16(VVCO) U2.17(VVCO) U2.26(PDBRF) U2.28(DVDD) U2.32(SDVDD) ; also sheet 2,4,8,9,11,13,14,15
ADFCE: R175.P$1 U2.4(CE)
CLK_N [looserdiffpair]: C152.P$1 ; also sheet 6
CLK_P [looserdiffpair]: C151.P$1 ; also sheet 6
CLKOUT [critical]: C51.P$2 ; also sheet 7
CLKOUTAC [critical]: C51.P$1 C154.P$2 R177.P$2
CPOUT: C155.P$1 R178.P$2 R185.P$1 U2.7(CPOUT)
GND: C142.P$1 C143.P$2 C144.P$2 C145.P$1 C146.P$1 C147.P$1 C148.P$1 C149.P$2 C150.P$2 C155.P$2 C156.P$2 C157.P$2 R156.P$1 R173.P$1 R174.P$1 R176.P$1 R177.P$1 U2.8(CPGND) U2.9(AGND) U2.11(AGNDVCO) U2.18(AGNDVCO) U2.21(AGNDVCO) U2.27(DGND) U2.31(SDGND) ; also sheet 1,2,3,4,6,7,8,9,10,11,12,13,14,15
LOCKDETECT: U2.25(LD) ; also sheet 8
MUXOUT: U2.30(MUXOUT) ; also sheet 8
N$17: C146.P$2 U2.19(TEMP)
N$20: C145.P$2 U2.23(VCOM)
N$21: R176.P$2 U2.22(RSET)
N$24: C157.P$1 R185.P$2
REF_CLK: C154.P$1 U2.29(REFIN)
RFOUTA_N [loosediffpair]: C151.P$2 R154.P$1 U2.13(RFOUTA-)
RFOUTA_P [loosediffpair]: C152.P$2 R153.P$1 U2.12(RFOUTA+)
SCLK3: R174.P$2 U2.1(CLK) ; also sheet 2,4,6,7,15
SCS3_CLK: R156.P$2 U2.3(LE) ; also sheet 7
SDI3: R173.P$2 U2.2(DATA) ; also sheet 2,4,6,7,15
VOUT: C150.P$1 R153.P$2 R154.P$2 R155.P$2
VREF2: C144.P$1 U2.24(VREF)
VTUNE: C156.P$1 R178.P$1 U2.20(VTUNE)
Unconnected: U2.5(SW) U2.14(RFOUTB+) U2.15(RFOUTB-)

### Notes on the sheet
- Status outputs to FPGA
- 50 MHz input clock
  from FPGA
- GND pads for ADF4350
- SPI from FPGA
- Unused
  output B
- 1.6 GHz differential
  output clock to ADC
- Filter for PLL bandwidth
- Clock

## Sheet 6 of 16: ADC
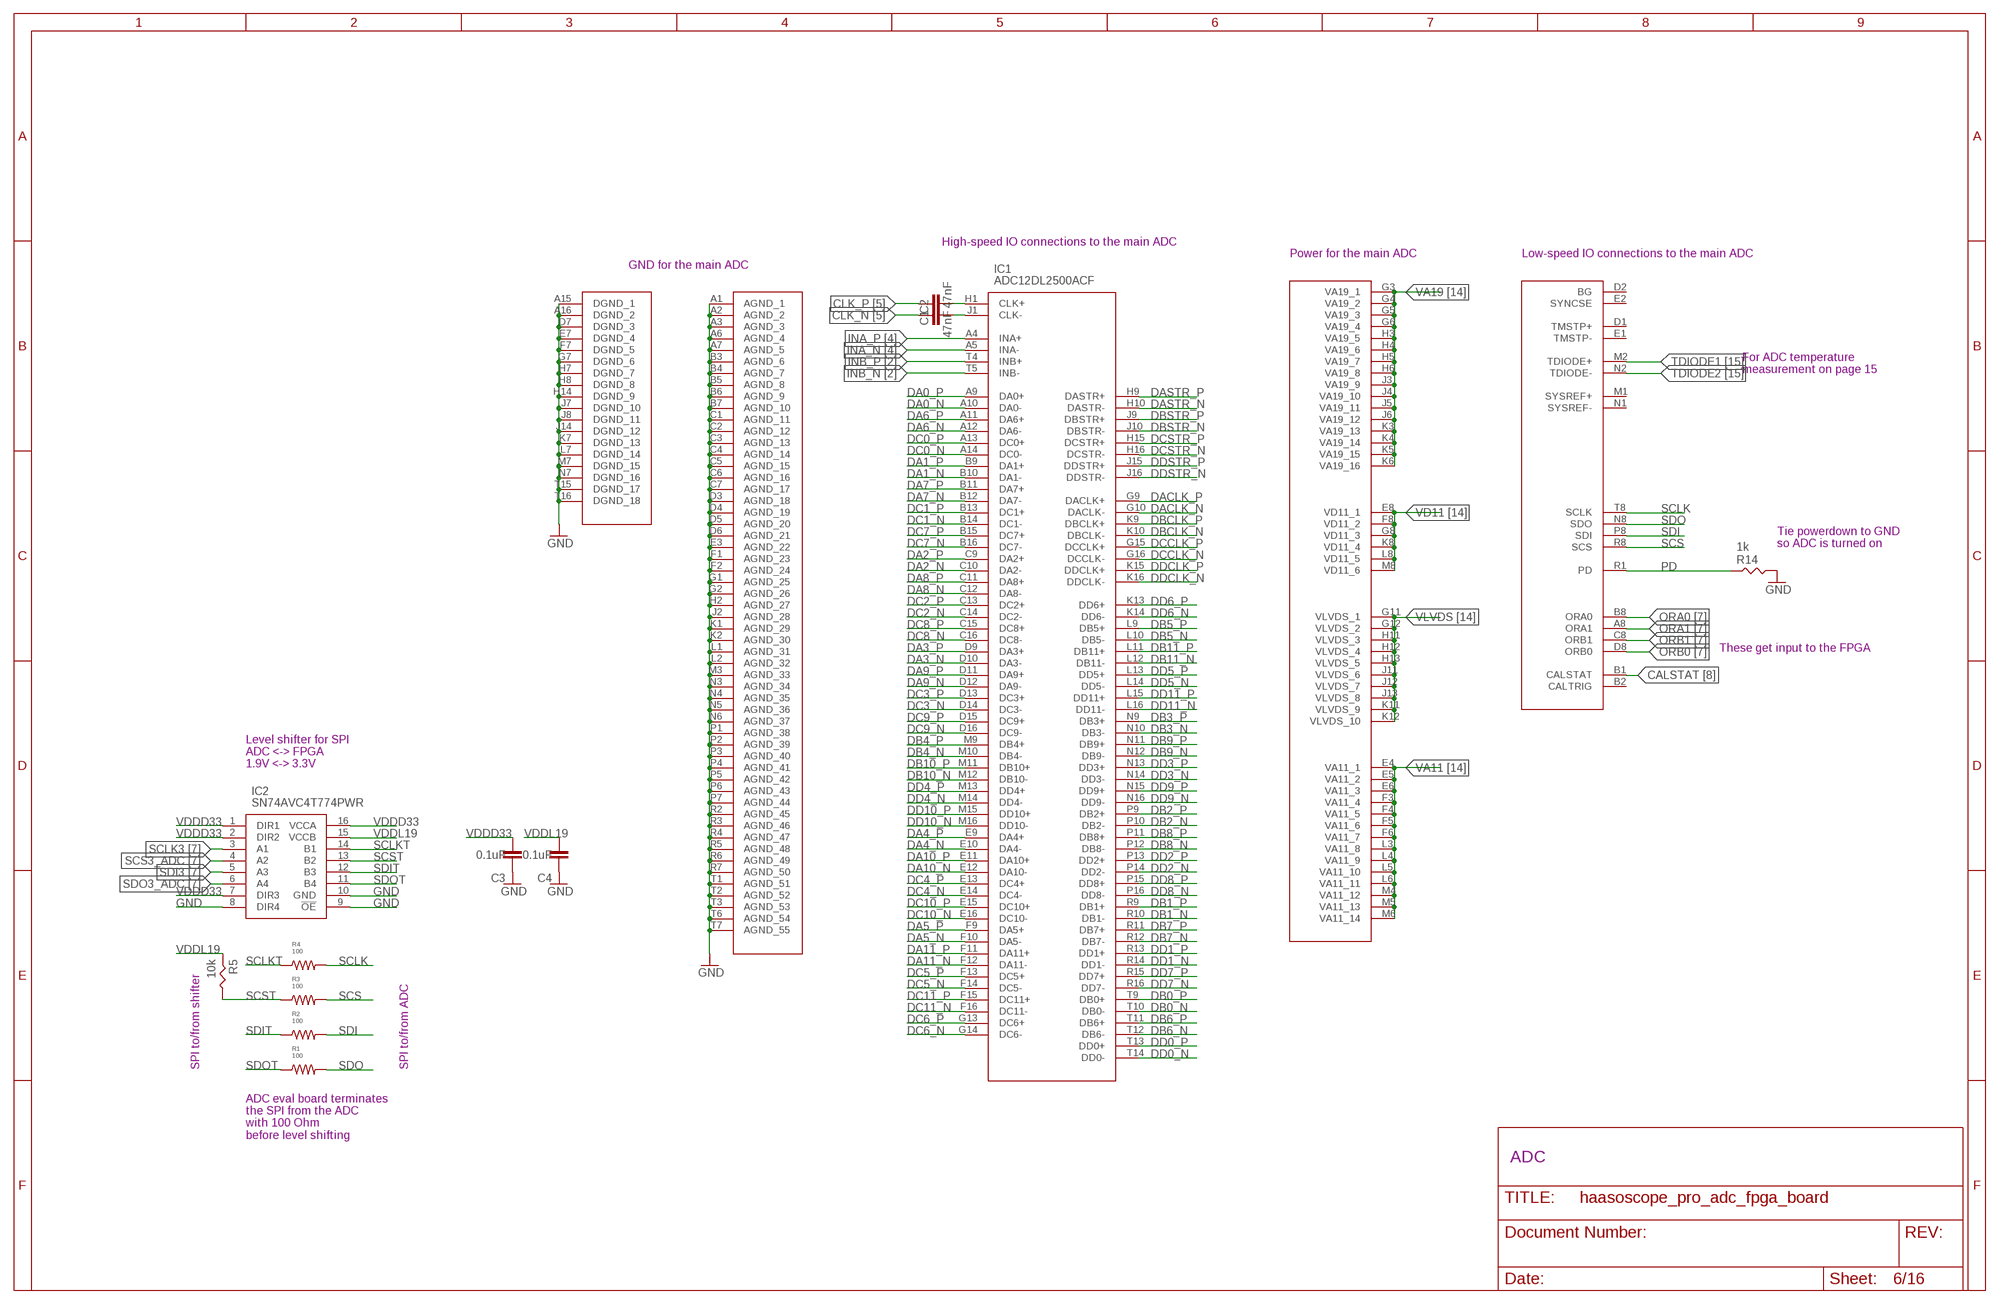
[diagram p5: schematic, sheet 6]

### Parts
C1  47nF  CAPACITOR_0402_N  [RESC0402_N]
C2  47nF  CAPACITOR_0402_N  [RESC0402_N]
C3  0.1uF  CAPACITOR_0402_N  [RESC0402_N]
C4  0.1uF  CAPACITOR_0402_N  [RESC0402_N]
IC1  ADC12DL2500ACF  [BGA256C100P16X16_1700X1700X331]
IC2  SN74AVC4T774PWR  [SOP65P640X120-16N]
R1  100  R-US_R0201  [R0201]
R2  100  R-US_R0201  [R0201]
R3  100  R-US_R0201  [R0201]
R4  100  R-US_R0201  [R0201]
R5  10k  RES-0402  [RES-0402]
R14  1k  RES-0402  [RES-0402]

### Nets
CALSTAT: IC1.B1(CALSTAT) ; also sheet 8
CLK_AC_N [looserdiffpair]: C1.1 IC1.J1(CLK-)
CLK_AC_P [looserdiffpair]: C2.2 IC1.H1(CLK+)
CLK_N [looserdiffpair]: C1.2 ; also sheet 5
CLK_P [looserdiffpair]: C2.1 ; also sheet 5
DA0_N [diffpair]: IC1.A10(DA0-) ; also sheet 7,8
DA0_P [diffpair]: IC1.A9(DA0+) ; also sheet 7,8
DA1_N [diffpair]: IC1.B10(DA1-) ; also sheet 7,8
DA1_P [diffpair]: IC1.B9(DA1+) ; also sheet 7,8
DA2_N [diffpair]: IC1.C10(DA2-) ; also sheet 7,8
DA2_P [diffpair]: IC1.C9(DA2+) ; also sheet 7,8
DA3_N [diffpair]: IC1.D10(DA3-) ; also sheet 7,8
DA3_P [diffpair]: IC1.D9(DA3+) ; also sheet 7,8
DA4_N [diffpair]: IC1.E10(DA4-) ; also sheet 7,8
DA4_P [diffpair]: IC1.E9(DA4+) ; also sheet 7,8
DA5_N [diffpair]: IC1.F10(DA5-) ; also sheet 7,8
DA5_P [diffpair]: IC1.F9(DA5+) ; also sheet 7,8
DA6_N [diffpair]: IC1.A12(DA6-) ; also sheet 7,8
DA6_P [diffpair]: IC1.A11(DA6+) ; also sheet 7,8
DA7_N [diffpair]: IC1.B12(DA7-) ; also sheet 7,8
DA7_P [diffpair]: IC1.B11(DA7+) ; also sheet 7,8
DA8_N [diffpair]: IC1.C12(DA8-) ; also sheet 7,8
DA8_P [diffpair]: IC1.C11(DA8+) ; also sheet 7,8
DA9_N [diffpair]: IC1.D12(DA9-) ; also sheet 7,8
DA9_P [diffpair]: IC1.D11(DA9+) ; also sheet 7,8
DA10_N [diffpair]: IC1.E12(DA10-) ; also sheet 7,8
DA10_P [diffpair]: IC1.E11(DA10+) ; also sheet 7,8
DA11_N [diffpair]: IC1.F12(DA11-) ; also sheet 7,8
DA11_P [diffpair]: IC1.F11(DA11+) ; also sheet 7,8
DACLK_N [diffpair]: IC1.G10(DACLK-) ; also sheet 7,8
DACLK_P [diffpair]: IC1.G9(DACLK+) ; also sheet 7,8
DASTR_N [diffpair]: IC1.H10(DASTR-) ; also sheet 7,8
DASTR_P [diffpair]: IC1.H9(DASTR+) ; also sheet 7,8
DB0_N [diffpair]: IC1.T10(DB0-) ; also sheet 7,8
DB0_P [diffpair]: IC1.T9(DB0+) ; also sheet 7,8
DB1_N [diffpair]: IC1.R10(DB1-) ; also sheet 7,8
DB1_P [diffpair]: IC1.R9(DB1+) ; also sheet 7,8
DB2_N [diffpair]: IC1.P10(DB2-) ; also sheet 7,8
DB2_P [diffpair]: IC1.P9(DB2+) ; also sheet 7,8
DB3_N [diffpair]: IC1.N10(DB3-) ; also sheet 7,8
DB3_P [diffpair]: IC1.N9(DB3+) ; also sheet 7,8
DB4_N [diffpair]: IC1.M10(DB4-) ; also sheet 7,8
DB4_P [diffpair]: IC1.M9(DB4+) ; also sheet 7,8
DB5_N [diffpair]: IC1.L10(DB5-) ; also sheet 7,8
DB5_P [diffpair]: IC1.L9(DB5+) ; also sheet 7,8
DB6_N [diffpair]: IC1.T12(DB6-) ; also sheet 7,8
DB6_P [diffpair]: IC1.T11(DB6+) ; also sheet 7,8
DB7_N [diffpair]: IC1.R12(DB7-) ; also sheet 7,8
DB7_P [diffpair]: IC1.R11(DB7+) ; also sheet 7,8
DB8_N [diffpair]: IC1.P12(DB8-) ; also sheet 7,8
DB8_P [diffpair]: IC1.P11(DB8+) ; also sheet 7,8
DB9_N [diffpair]: IC1.N12(DB9-) ; also sheet 7,8
DB9_P [diffpair]: IC1.N11(DB9+) ; also sheet 7,8
DB10_N [diffpair]: IC1.M12(DB10-) ; also sheet 7,8
DB10_P [diffpair]: IC1.M11(DB10+) ; also sheet 7,8
DB11_N [diffpair]: IC1.L12(DB11-) ; also sheet 7,8
DB11_P [diffpair]: IC1.L11(DB11+) ; also sheet 7,8
DBCLK_N [diffpair]: IC1.K10(DBCLK-) ; also sheet 7,8
DBCLK_P [diffpair]: IC1.K9(DBCLK+) ; also sheet 7,8
DBSTR_N [diffpair]: IC1.J10(DBSTR-) ; also sheet 7,8
DBSTR_P [diffpair]: IC1.J9(DBSTR+) ; also sheet 7,8
DC0_N [diffpair]: IC1.A14(DC0-) ; also sheet 7,8
DC0_P [diffpair]: IC1.A13(DC0+) ; also sheet 7,8
DC1_N [diffpair]: IC1.B14(DC1-) ; also sheet 7,8
DC1_P [diffpair]: IC1.B13(DC1+) ; also sheet 7,8
DC2_N [diffpair]: IC1.C14(DC2-) ; also sheet 7,8
DC2_P [diffpair]: IC1.C13(DC2+) ; also sheet 7,8
DC3_N [diffpair]: IC1.D14(DC3-) ; also sheet 7,8
DC3_P [diffpair]: IC1.D13(DC3+) ; also sheet 7,8
DC4_N [diffpair]: IC1.E14(DC4-) ; also sheet 7,8
DC4_P [diffpair]: IC1.E13(DC4+) ; also sheet 7,8
DC5_N [diffpair]: IC1.F14(DC5-) ; also sheet 7,8
DC5_P [diffpair]: IC1.F13(DC5+) ; also sheet 7,8
DC6_N [diffpair]: IC1.G14(DC6-) ; also sheet 7,8
DC6_P [diffpair]: IC1.G13(DC6+) ; also sheet 7,8
DC7_N [diffpair]: IC1.B16(DC7-) ; also sheet 7,8
DC7_P [diffpair]: IC1.B15(DC7+) ; also sheet 7,8
DC8_N [diffpair]: IC1.C16(DC8-) ; also sheet 7,8
DC8_P [diffpair]: IC1.C15(DC8+) ; also sheet 7,8
DC9_N [diffpair]: IC1.D16(DC9-) ; also sheet 7,8
DC9_P [diffpair]: IC1.D15(DC9+) ; also sheet 7,8
DC10_N [diffpair]: IC1.E16(DC10-) ; also sheet 7,8
DC10_P [diffpair]: IC1.E15(DC10+) ; also sheet 7,8
DC11_N [diffpair]: IC1.F16(DC11-) ; also sheet 7,8
DC11_P [diffpair]: IC1.F15(DC11+) ; also sheet 7,8
DCCLK_N [diffpair]: IC1.G16(DCCLK-) ; also sheet 7,8
DCCLK_P [diffpair]: IC1.G15(DCCLK+) ; also sheet 7,8
DCSTR_N [diffpair]: IC1.H16(DCSTR-) ; also sheet 7,8
DCSTR_P [diffpair]: IC1.H15(DCSTR+) ; also sheet 7,8
DD0_N [diffpair]: IC1.T14(DD0-) ; also sheet 7,8
DD0_P [diffpair]: IC1.T13(DD0+) ; also sheet 7,8
DD1_N [diffpair]: IC1.R14(DD1-) ; also sheet 7,8
DD1_P [diffpair]: IC1.R13(DD1+) ; also sheet 7,8
DD2_N [diffpair]: IC1.P14(DD2-) ; also sheet 7,8
DD2_P [diffpair]: IC1.P13(DD2+) ; also sheet 7,8
DD3_N [diffpair]: IC1.N14(DD3-) ; also sheet 7,8
DD3_P [diffpair]: IC1.N13(DD3+) ; also sheet 7,8
DD4_N [diffpair]: IC1.M14(DD4-) ; also sheet 7,8
DD4_P [diffpair]: IC1.M13(DD4+) ; also sheet 7,8
DD5_N [diffpair]: IC1.L14(DD5-) ; also sheet 7,8
DD5_P [diffpair]: IC1.L13(DD5+) ; also sheet 7,8
DD6_N [diffpair]: IC1.K14(DD6-) ; also sheet 7,8
DD6_P [diffpair]: IC1.K13(DD6+) ; also sheet 7,8
DD7_N [diffpair]: IC1.R16(DD7-) ; also sheet 7,8
DD7_P [diffpair]: IC1.R15(DD7+) ; also sheet 7,8
DD8_N [diffpair]: IC1.P16(DD8-) ; also sheet 7,8
DD8_P [diffpair]: IC1.P15(DD8+) ; also sheet 7,8
DD9_N [diffpair]: IC1.N16(DD9-) ; also sheet 7,8
DD9_P [diffpair]: IC1.N15(DD9+) ; also sheet 7,8
DD10_N [diffpair]: IC1.M16(DD10-) ; also sheet 7,8
DD10_P [diffpair]: IC1.M15(DD10+) ; also sheet 7,8
DD11_N [diffpair]: IC1.L16(DD11-) ; also sheet 7,8
DD11_P [diffpair]: IC1.L15(DD11+) ; also sheet 7,8
DDCLK_N [diffpair]: IC1.K16(DDCLK-) ; also sheet 7,8
DDCLK_P [diffpair]: IC1.K15(DDCLK+) ; also sheet 7,8
DDSTR_N [diffpair]: IC1.J16(DDSTR-) ; also sheet 7,8
DDSTR_P [diffpair]: IC1.J15(DDSTR+) ; also sheet 7,8
GND: C3.1 C4.1 IC1.A1(AGND_1) IC1.A2(AGND_2) IC1.A3(AGND_3) IC1.A6(AGND_4) IC1.A7(AGND_5) IC1.A15(DGND_1) IC1.A16(DGND_2) IC1.B3(AGND_6) IC1.B4(AGND_7) IC1.B5(AGND_8) IC1.B6(AGND_9) IC1.B7(AGND_10) IC1.C1(AGND_11) IC1.C2(AGND_12) IC1.C3(AGND_13) IC1.C4(AGND_14) IC1.C5(AGND_15) IC1.C6(AGND_16) IC1.C7(AGND_17) IC1.D3(AGND_18) IC1.D4(AGND_19) IC1.D5(AGND_20) IC1.D6(AGND_21) IC1.D7(DGND_3) IC1.E3(AGND_22) IC1.E7(DGND_4) IC1.F1(AGND_23) IC1.F2(AGND_24) IC1.F7(DGND_5) IC1.G1(AGND_25) IC1.G2(AGND_26) IC1.G7(DGND_6) IC1.H2(AGND_27) IC1.H7(DGND_7) IC1.H8(DGND_8) IC1.H14(DGND_9) IC1.J2(AGND_28) IC1.J7(DGND_10) IC1.J8(DGND_11) IC1.J14(DGND_12) IC1.K1(AGND_29) IC1.K2(AGND_30) IC1.K7(DGND_13) IC1.L1(AGND_31) IC1.L2(AGND_32) IC1.L7(DGND_14) IC1.M3(AGND_33) IC1.M7(DGND_15) IC1.N3(AGND_34) IC1.N4(AGND_35) IC1.N5(AGND_36) IC1.N6(AGND_37) IC1.N7(DGND_16) IC1.P1(AGND_38) IC1.P2(AGND_39) IC1.P3(AGND_40) IC1.P4(AGND_41) IC1.P5(AGND_42) IC1.P6(AGND_43) IC1.P7(AGND_44) IC1.R2(AGND_45) IC1.R3(AGND_46) IC1.R4(AGND_47) IC1.R5(AGND_48) IC1.R6(AGND_49) IC1.R7(AGND_50) IC1.T1(AGND_51) IC1.T2(AGND_52) IC1.T3(AGND_53) IC1.T6(AGND_54) IC1.T7(AGND_55) IC1.T15(DGND_17) IC1.T16(DGND_18) IC2.8(DIR4) IC2.9(!OE) IC2.10(GND) R14.P$2 ; also sheet 1,2,3,4,5,7,8,9,10,11,12,13,14,15
INA_N [looserdiffpair]: IC1.A5(INA-) ; also sheet 4
INA_P [looserdiffpair]: IC1.A4(INA+) ; also sheet 4
INB_N [looserdiffpair]: IC1.T5(INB-) ; also sheet 2
INB_P [looserdiffpair]: IC1.T4(INB+) ; also sheet 2
ORA0: IC1.B8(ORA0) ; also sheet 7
ORA1: IC1.A8(ORA1) ; also sheet 7
ORB0: IC1.D8(ORB0) ; also sheet 7
ORB1: IC1.C8(ORB1) ; also sheet 7
PD: IC1.R1(PD) R14.P$1
SCLK: IC1.T8(SCLK) R4.2
SCLK3: IC2.3(A1) ; also sheet 2,4,5,7,15
SCLKT: IC2.14(B1) R4.1
SCS: IC1.R8(SCS) R3.2
SCS3_ADC: IC2.4(A2) ; also sheet 7
SCST: IC2.13(B2) R3.1 R5.P$2
SDI: IC1.P8(SDI) R2.2
SDI3: IC2.5(A3) ; also sheet 2,4,5,7,15
SDIT: IC2.12(B3) R2.1
SDO: IC1.N8(SDO) R1.2
SDO3_ADC: IC2.6(A4) ; also sheet 7
SDOT: IC2.11(B4) R1.1
TDIODE1: IC1.M2(TDIODE+) ; also sheet 15
TDIODE2: IC1.N2(TDIODE-) ; also sheet 15
VA11 [power]: IC1.E4(VA11_1) IC1.E5(VA11_2) IC1.E6(VA11_3) IC1.F3(VA11_4) IC1.F4(VA11_5) IC1.F5(VA11_6) IC1.F6(VA11_7) IC1.L3(VA11_8) IC1.L4(VA11_9) IC1.L5(VA11_10) IC1.L6(VA11_11) IC1.M4(VA11_12) IC1.M5(VA11_13) IC1.M6(VA11_14) ; also sheet 14
VA19 [power]: IC1.G3(VA19_1) IC1.G4(VA19_2) IC1.G5(VA19_3) IC1.G6(VA19_4) IC1.H3(VA19_5) IC1.H4(VA19_6) IC1.H5(VA19_7) IC1.H6(VA19_8) IC1.J3(VA19_9) IC1.J4(VA19_10) IC1.J5(VA19_11) IC1.J6(VA19_12) IC1.K3(VA19_13) IC1.K4(VA19_14) IC1.K5(VA19_15) IC1.K6(VA19_16) ; also sheet 14
VD11 [power]: IC1.E8(VD11_1) IC1.F8(VD11_2) IC1.G8(VD11_3) IC1.K8(VD11_4) IC1.L8(VD11_5) IC1.M8(VD11_6) ; also sheet 14
VDDD33 [power]: C3.2 IC2.1(DIR1) IC2.2(DIR2) IC2.7(DIR3) IC2.16(VCCA) ; also sheet 14
VDDL19 [power]: C4.2 IC2.15(VCCB) R5.P$1 ; also sheet 14
VLVDS [power]: IC1.G11(VLVDS_1) IC1.G12(VLVDS_2) IC1.H11(VLVDS_3) IC1.H12(VLVDS_4) IC1.H13(VLVDS_5) IC1.J11(VLVDS_6) IC1.J12(VLVDS_7) IC1.J13(VLVDS_8) IC1.K11(VLVDS_9) IC1.K12(VLVDS_10) ; also sheet 14
Unconnected: IC1.B2(CALTRIG) IC1.D1(TMSTP+) IC1.D2(BG) IC1.E1(TMSTP-) IC1.E2(SYNCSE) IC1.M1(SYSREF+) IC1.N1(SYSREF-)

### Notes on the sheet
- High-speed IO connections to the main ADC
- Power for the main ADC | Low-speed IO connections to the main ADC
- GND for the main ADC
- For ADC temperature
  measurement on page 15
- Tie powerdown to GND
  so ADC is turned on
- These get input to the FPGA
- Level shifter for SPI
  ADC <-> FPGA
  1.9V <-> 3.3V
- SPI to/from shifter | SPI to/from ADC
- ADC eval board terminates
  the SPI from the ADC 
  with 100 Ohm
  before level shifting
- ADC

## Sheet 7 of 16: FPGA and IOs
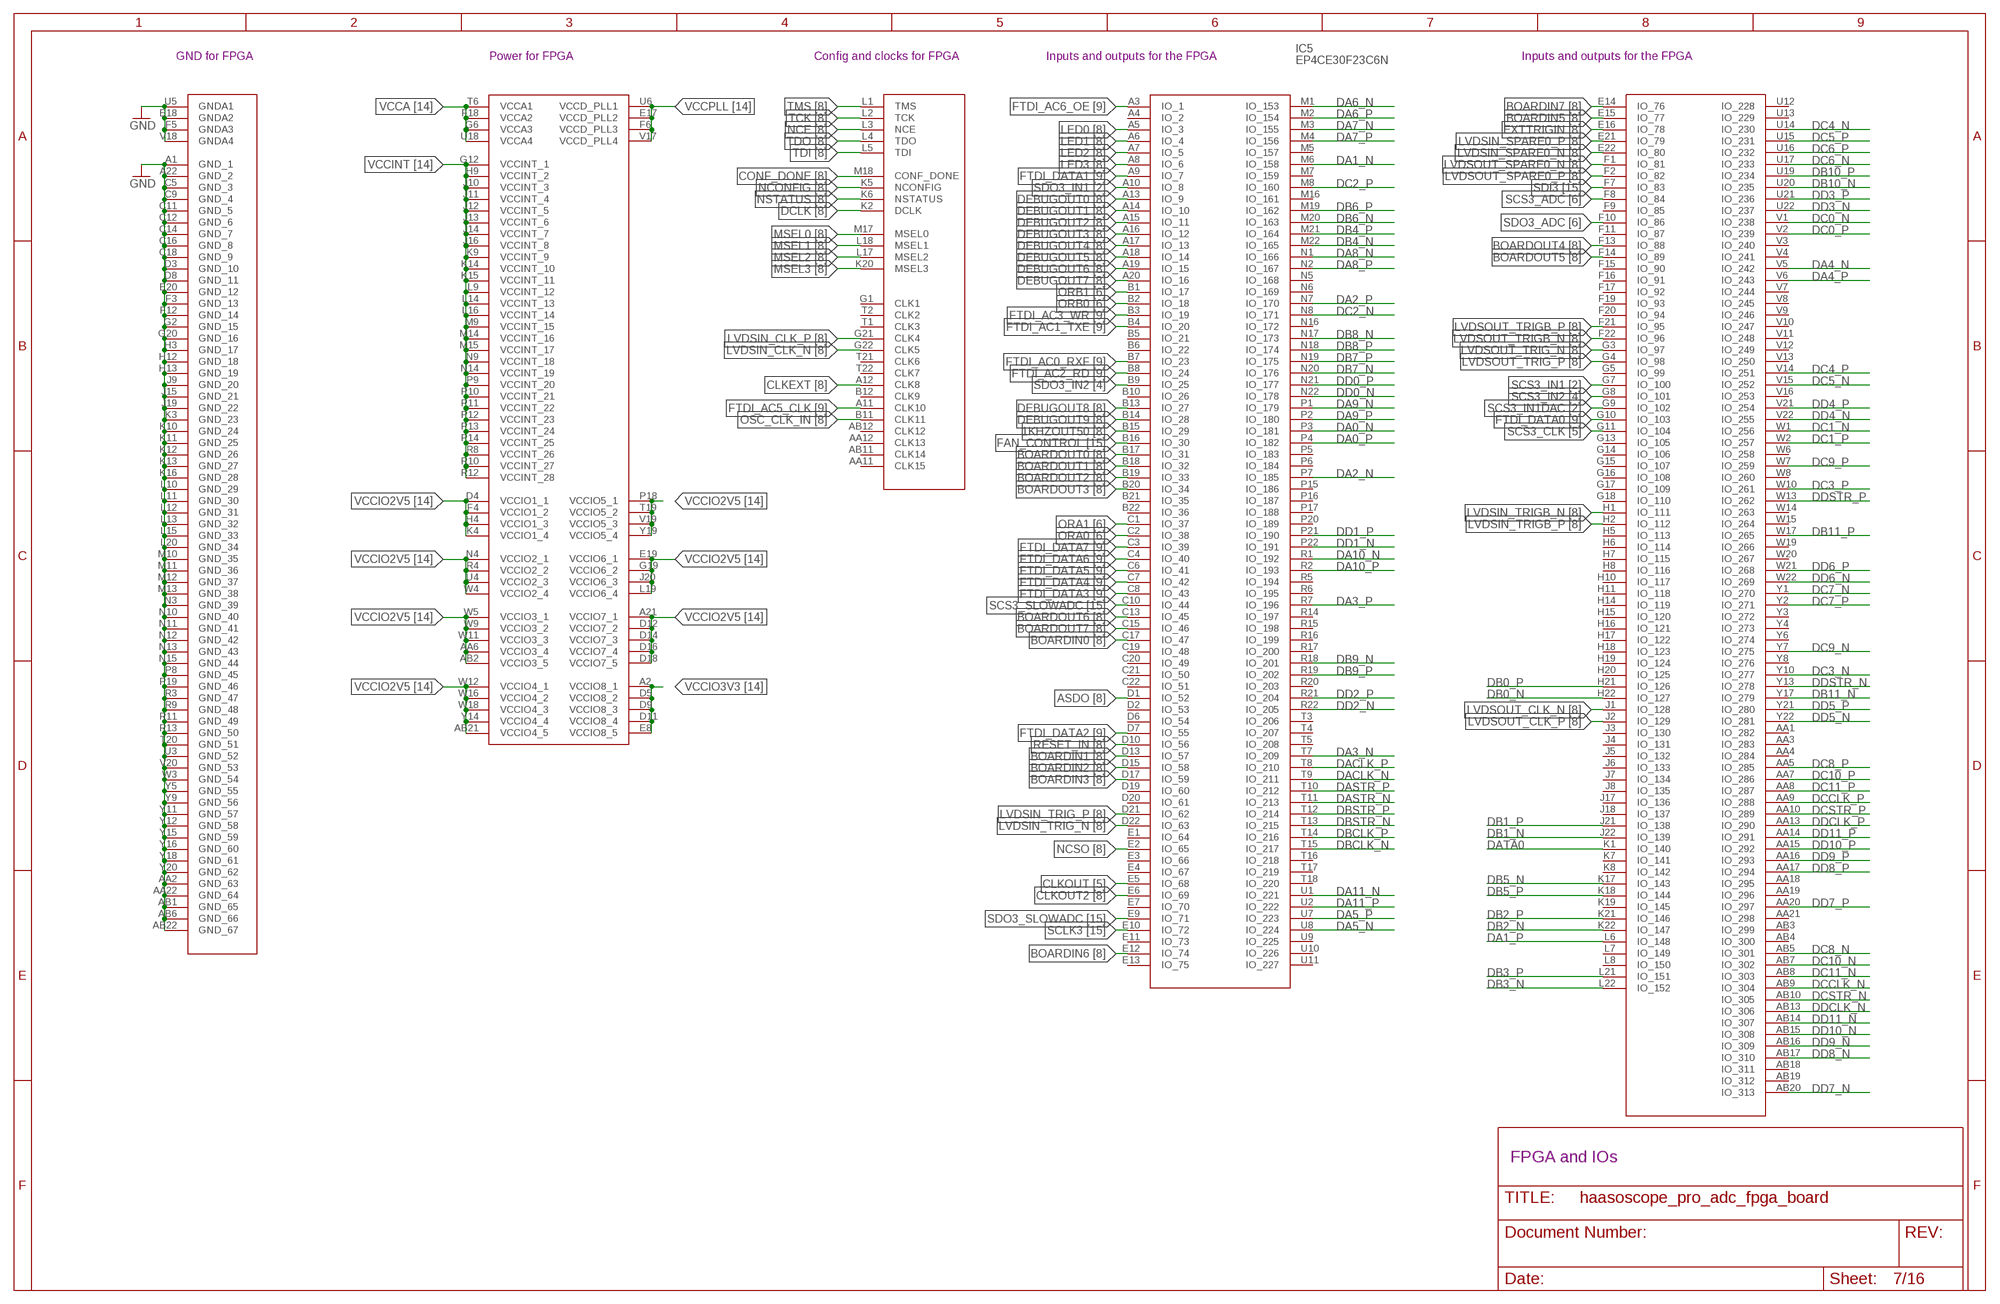
[diagram p6: schematic, sheet 7]

### Parts
IC5  EP4CE30F23C6N  [BGA484C100P22X22_2300X2300X240]

### Nets
1KHZOUT50: IC5.B15(IO_29) ; also sheet 8
ASDO: IC5.D1(IO_52) ; also sheet 8
BOARDIN0: IC5.C17(IO_47) ; also sheet 8
BOARDIN1: IC5.D13(IO_57) ; also sheet 8
BOARDIN2: IC5.D15(IO_58) ; also sheet 8
BOARDIN3: IC5.D17(IO_59) ; also sheet 8
BOARDIN5: IC5.E15(IO_77) ; also sheet 8
BOARDIN6: IC5.E12(IO_74) ; also sheet 8
BOARDIN7: IC5.E14(IO_76) ; also sheet 8
BOARDOUT0: IC5.B17(IO_31) ; also sheet 8
BOARDOUT1: IC5.B18(IO_32) ; also sheet 8
BOARDOUT2: IC5.B19(IO_33) ; also sheet 8
BOARDOUT3: IC5.B20(IO_34) ; also sheet 8
BOARDOUT4: IC5.F13(IO_88) ; also sheet 8
BOARDOUT5: IC5.F14(IO_89) ; also sheet 8
BOARDOUT6: IC5.C13(IO_45) ; also sheet 8
BOARDOUT7: IC5.C15(IO_46) ; also sheet 8
CLKEXT [critical]: IC5.A12(CLK8) ; also sheet 8
CLKOUT [critical]: IC5.E5(IO_68) ; also sheet 5
CLKOUT2 [critical]: IC5.E6(IO_69) ; also sheet 8
CONF_DONE: IC5.M18(CONF_DONE) ; also sheet 8
DA0_N [diffpair]: IC5.P3(IO_181) ; also sheet 6,8
DA0_P [diffpair]: IC5.P4(IO_182) ; also sheet 6,8
DA1_N [diffpair]: IC5.M6(IO_158) ; also sheet 6,8
DA1_P [diffpair]: IC5.L6(IO_148) ; also sheet 6,8
DA2_N [diffpair]: IC5.P7(IO_185) ; also sheet 6,8
DA2_P [diffpair]: IC5.N7(IO_170) ; also sheet 6,8
DA3_N [diffpair]: IC5.T7(IO_209) ; also sheet 6,8
DA3_P [diffpair]: IC5.R7(IO_196) ; also sheet 6,8
DA4_N [diffpair]: IC5.V5(IO_242) ; also sheet 6,8
DA4_P [diffpair]: IC5.V6(IO_243) ; also sheet 6,8
DA5_N [diffpair]: IC5.U8(IO_224) ; also sheet 6,8
DA5_P [diffpair]: IC5.U7(IO_223) ; also sheet 6,8
DA6_N [diffpair]: IC5.M1(IO_153) ; also sheet 6,8
DA6_P [diffpair]: IC5.M2(IO_154) ; also sheet 6,8
DA7_N [diffpair]: IC5.M3(IO_155) ; also sheet 6,8
DA7_P [diffpair]: IC5.M4(IO_156) ; also sheet 6,8
DA8_N [diffpair]: IC5.N1(IO_166) ; also sheet 6,8
DA8_P [diffpair]: IC5.N2(IO_167) ; also sheet 6,8
DA9_N [diffpair]: IC5.P1(IO_179) ; also sheet 6,8
DA9_P [diffpair]: IC5.P2(IO_180) ; also sheet 6,8
DA10_N [diffpair]: IC5.R1(IO_192) ; also sheet 6,8
DA10_P [diffpair]: IC5.R2(IO_193) ; also sheet 6,8
DA11_N [diffpair]: IC5.U1(IO_221) ; also sheet 6,8
DA11_P [diffpair]: IC5.U2(IO_222) ; also sheet 6,8
DACLK_N [diffpair]: IC5.T9(IO_211) ; also sheet 6,8
DACLK_P [diffpair]: IC5.T8(IO_210) ; also sheet 6,8
DASTR_N [diffpair]: IC5.T11(IO_213) ; also sheet 6,8
DASTR_P [diffpair]: IC5.T10(IO_212) ; also sheet 6,8
DATA0: IC5.K1(IO_140) ; also sheet 8
DB0_N [diffpair]: IC5.H22(IO_127) ; also sheet 6,8
DB0_P [diffpair]: IC5.H21(IO_126) ; also sheet 6,8
DB1_N [diffpair]: IC5.J22(IO_139) ; also sheet 6,8
DB1_P [diffpair]: IC5.J21(IO_138) ; also sheet 6,8
DB2_N [diffpair]: IC5.K22(IO_147) ; also sheet 6,8
DB2_P [diffpair]: IC5.K21(IO_146) ; also sheet 6,8
DB3_N [diffpair]: IC5.L22(IO_152) ; also sheet 6,8
DB3_P [diffpair]: IC5.L21(IO_151) ; also sheet 6,8
DB4_N [diffpair]: IC5.M22(IO_165) ; also sheet 6,8
DB4_P [diffpair]: IC5.M21(IO_164) ; also sheet 6,8
DB5_N [diffpair]: IC5.K17(IO_143) ; also sheet 6,8
DB5_P [diffpair]: IC5.K18(IO_144) ; also sheet 6,8
DB6_N [diffpair]: IC5.M20(IO_163) ; also sheet 6,8
DB6_P [diffpair]: IC5.M19(IO_162) ; also sheet 6,8
DB7_N [diffpair]: IC5.N20(IO_176) ; also sheet 6,8
DB7_P [diffpair]: IC5.N19(IO_175) ; also sheet 6,8
DB8_N [diffpair]: IC5.N17(IO_173) ; also sheet 6,8
DB8_P [diffpair]: IC5.N18(IO_174) ; also sheet 6,8
DB9_N [diffpair]: IC5.R18(IO_201) ; also sheet 6,8
DB9_P [diffpair]: IC5.R19(IO_202) ; also sheet 6,8
DB10_N [diffpair]: IC5.U20(IO_235) ; also sheet 6,8
DB10_P [diffpair]: IC5.U19(IO_234) ; also sheet 6,8
DB11_N [diffpair]: IC5.Y17(IO_279) ; also sheet 6,8
DB11_P [diffpair]: IC5.W17(IO_265) ; also sheet 6,8
DBCLK_N [diffpair]: IC5.T15(IO_217) ; also sheet 6,8
DBCLK_P [diffpair]: IC5.T14(IO_216) ; also sheet 6,8
DBSTR_N [diffpair]: IC5.T13(IO_215) ; also sheet 6,8
DBSTR_P [diffpair]: IC5.T12(IO_214) ; also sheet 6,8
DC0_N [diffpair]: IC5.V1(IO_238) ; also sheet 6,8
DC0_P [diffpair]: IC5.V2(IO_239) ; also sheet 6,8
DC1_N [diffpair]: IC5.W1(IO_256) ; also sheet 6,8
DC1_P [diffpair]: IC5.W2(IO_257) ; also sheet 6,8
DC2_N [diffpair]: IC5.N8(IO_171) ; also sheet 6,8
DC2_P [diffpair]: IC5.M8(IO_160) ; also sheet 6,8
DC3_N [diffpair]: IC5.Y10(IO_277) ; also sheet 6,8
DC3_P [diffpair]: IC5.W10(IO_261) ; also sheet 6,8
DC4_N [diffpair]: IC5.U14(IO_230) ; also sheet 6,8
DC4_P [diffpair]: IC5.V14(IO_251) ; also sheet 6,8
DC5_N [diffpair]: IC5.V15(IO_252) ; also sheet 6,8
DC5_P [diffpair]: IC5.U15(IO_231) ; also sheet 6,8
DC6_N [diffpair]: IC5.U17(IO_233) ; also sheet 6,8
DC6_P [diffpair]: IC5.U16(IO_232) ; also sheet 6,8
DC7_N [diffpair]: IC5.Y1(IO_270) ; also sheet 6,8
DC7_P [diffpair]: IC5.Y2(IO_271) ; also sheet 6,8
DC8_N [diffpair]: IC5.AB5(IO_301) ; also sheet 6,8
DC8_P [diffpair]: IC5.AA5(IO_285) ; also sheet 6,8
DC9_N [diffpair]: IC5.Y7(IO_275) ; also sheet 6,8
DC9_P [diffpair]: IC5.W7(IO_259) ; also sheet 6,8
DC10_N [diffpair]: IC5.AB7(IO_302) ; also sheet 6,8
DC10_P [diffpair]: IC5.AA7(IO_286) ; also sheet 6,8
DC11_N [diffpair]: IC5.AB8(IO_303) ; also sheet 6,8
DC11_P [diffpair]: IC5.AA8(IO_287) ; also sheet 6,8
DCCLK_N [diffpair]: IC5.AB9(IO_304) ; also sheet 6,8
DCCLK_P [diffpair]: IC5.AA9(IO_288) ; also sheet 6,8
DCLK: IC5.K2(DCLK) ; also sheet 8
DCSTR_N [diffpair]: IC5.AB10(IO_305) ; also sheet 6,8
DCSTR_P [diffpair]: IC5.AA10(IO_289) ; also sheet 6,8
DD0_N [diffpair]: IC5.N22(IO_178) ; also sheet 6,8
DD0_P [diffpair]: IC5.N21(IO_177) ; also sheet 6,8
DD1_N [diffpair]: IC5.P22(IO_191) ; also sheet 6,8
DD1_P [diffpair]: IC5.P21(IO_190) ; also sheet 6,8
DD2_N [diffpair]: IC5.R22(IO_205) ; also sheet 6,8
DD2_P [diffpair]: IC5.R21(IO_204) ; also sheet 6,8
DD3_N [diffpair]: IC5.U22(IO_237) ; also sheet 6,8
DD3_P [diffpair]: IC5.U21(IO_236) ; also sheet 6,8
DD4_N [diffpair]: IC5.V22(IO_255) ; also sheet 6,8
DD4_P [diffpair]: IC5.V21(IO_254) ; also sheet 6,8
DD5_N [diffpair]: IC5.Y22(IO_281) ; also sheet 6,8
DD5_P [diffpair]: IC5.Y21(IO_280) ; also sheet 6,8
DD6_N [diffpair]: IC5.W22(IO_269) ; also sheet 6,8
DD6_P [diffpair]: IC5.W21(IO_268) ; also sheet 6,8
DD7_N [diffpair]: IC5.AB20(IO_313) ; also sheet 6,8
DD7_P [diffpair]: IC5.AA20(IO_297) ; also sheet 6,8
DD8_N [diffpair]: IC5.AB17(IO_310) ; also sheet 6,8
DD8_P [diffpair]: IC5.AA17(IO_294) ; also sheet 6,8
DD9_N [diffpair]: IC5.AB16(IO_309) ; also sheet 6,8
DD9_P [diffpair]: IC5.AA16(IO_293) ; also sheet 6,8
DD10_N [diffpair]: IC5.AB15(IO_308) ; also sheet 6,8
DD10_P [diffpair]: IC5.AA15(IO_292) ; also sheet 6,8
DD11_N [diffpair]: IC5.AB14(IO_307) ; also sheet 6,8
DD11_P [diffpair]: IC5.AA14(IO_291) ; also sheet 6,8
DDCLK_N [diffpair]: IC5.AB13(IO_306) ; also sheet 6,8
DDCLK_P [diffpair]: IC5.AA13(IO_290) ; also sheet 6,8
DDSTR_N [diffpair]: IC5.Y13(IO_278) ; also sheet 6,8
DDSTR_P [diffpair]: IC5.W13(IO_262) ; also sheet 6,8
DEBUGOUT0: IC5.A13(IO_9) ; also sheet 8
DEBUGOUT1: IC5.A14(IO_10) ; also sheet 8
DEBUGOUT2: IC5.A15(IO_11) ; also sheet 8
DEBUGOUT3: IC5.A16(IO_12) ; also sheet 8
DEBUGOUT4: IC5.A17(IO_13) ; also sheet 8
DEBUGOUT5: IC5.A18(IO_14) ; also sheet 8
DEBUGOUT6: IC5.A19(IO_15) ; also sheet 8
DEBUGOUT7: IC5.A20(IO_16) ; also sheet 8
DEBUGOUT8: IC5.B13(IO_27) ; also sheet 8
DEBUGOUT9: IC5.B14(IO_28) ; also sheet 8
EXTTRIGIN [critical]: IC5.E16(IO_78) ; also sheet 8
FAN_CONTROL: IC5.B16(IO_30) ; also sheet 15
FTDI_AC0_RXF [critical]: IC5.B7(IO_23) ; also sheet 9
FTDI_AC1_TXE [critical]: IC5.B4(IO_20) ; also sheet 9
FTDI_AC2_RD [critical]: IC5.B8(IO_24) ; also sheet 9
FTDI_AC3_WR [critical]: IC5.B3(IO_19) ; also sheet 9
FTDI_AC5_CLK [critical]: IC5.A11(CLK10) ; also sheet 9
FTDI_AC6_OE [critical]: IC5.A3(IO_1) ; also sheet 9
FTDI_DATA0 [critical]: IC5.G10(IO_103) ; also sheet 9
FTDI_DATA1 [critical]: IC5.A9(IO_7) ; also sheet 9
FTDI_DATA2 [critical]: IC5.D7(IO_55) ; also sheet 9
FTDI_DATA3 [critical]: IC5.C8(IO_43) ; also sheet 9
FTDI_DATA4 [critical]: IC5.C7(IO_42) ; also sheet 9
FTDI_DATA5 [critical]: IC5.C6(IO_41) ; also sheet 9
FTDI_DATA6 [critical]: IC5.C4(IO_40) ; also sheet 9
FTDI_DATA7 [critical]: IC5.C3(IO_39) ; also sheet 9
GND: IC5.A1(GND_1) IC5.A22(GND_2) IC5.AA2(GND_63) IC5.AA22(GND_64) IC5.AB1(GND_65) IC5.AB6(GND_66) IC5.AB22(GND_67) IC5.C5(GND_3) IC5.C9(GND_4) IC5.C11(GND_5) IC5.C12(GND_6) IC5.C14(GND_7) IC5.C16(GND_8) IC5.C18(GND_9) IC5.D3(GND_10) IC5.D8(GND_11) IC5.E18(GNDA2) IC5.E20(GND_12) IC5.F3(GND_13) IC5.F5(GNDA3) IC5.F12(GND_14) IC5.G2(GND_15) IC5.G20(GND_16) IC5.H3(GND_17) IC5.H12(GND_18) IC5.H13(GND_19) IC5.J9(GND_20) IC5.J15(GND_21) IC5.J19(GND_22) IC5.K3(GND_23) IC5.K10(GND_24) IC5.K11(GND_25) IC5.K12(GND_26) IC5.K13(GND_27) IC5.K16(GND_28) IC5.L10(GND_29) IC5.L11(GND_30) IC5.L12(GND_31) IC5.L13(GND_32) IC5.L15(GND_33) IC5.L20(GND_34) IC5.M10(GND_35) IC5.M11(GND_36) IC5.M12(GND_37) IC5.M13(GND_38) IC5.N3(GND_39) IC5.N10(GND_40) IC5.N11(GND_41) IC5.N12(GND_42) IC5.N13(GND_43) IC5.N15(GND_44) IC5.P8(GND_45) IC5.P19(GND_46) IC5.R3(GND_47) IC5.R9(GND_48) IC5.R11(GND_49) IC5.R13(GND_50) IC5.T20(GND_51) IC5.U3(GND_52) IC5.U5(GNDA1) IC5.V18(GNDA4) IC5.V20(GND_53) IC5.W3(GND_54) IC5.Y5(GND_55) IC5.Y9(GND_56) IC5.Y11(GND_57) IC5.Y12(GND_58) IC5.Y15(GND_59) IC5.Y16(GND_60) IC5.Y18(GND_61) IC5.Y20(GND_62) ; also sheet 1,2,3,4,5,6,8,9,10,11,12,13,14,15
LED0: IC5.A5(IO_3) ; also sheet 8
LED1: IC5.A6(IO_4) ; also sheet 8
LED2: IC5.A7(IO_5) ; also sheet 8
LED3: IC5.A8(IO_6) ; also sheet 8
LVDSIN_CLK_N [diffpair]: IC5.G22(CLK5) ; also sheet 8
LVDSIN_CLK_P [diffpair]: IC5.G21(CLK4) ; also sheet 8
LVDSIN_SPARE0_N [diffpair]: IC5.E22(IO_80) ; also sheet 8
LVDSIN_SPARE0_P [diffpair]: IC5.E21(IO_79) ; also sheet 8
LVDSIN_TRIG_N [diffpair]: IC5.D22(IO_63) ; also sheet 8
LVDSIN_TRIG_P [diffpair]: IC5.D21(IO_62) ; also sheet 8
LVDSIN_TRIGB_N [diffpair]: IC5.H1(IO_111) ; also sheet 8
LVDSIN_TRIGB_P [diffpair]: IC5.H2(IO_112) ; also sheet 8
LVDSOUT_CLK_N [diffpair]: IC5.J1(IO_128) ; also sheet 8
LVDSOUT_CLK_P [diffpair]: IC5.J2(IO_129) ; also sheet 8
LVDSOUT_SPARE0_N [diffpair]: IC5.F1(IO_81) ; also sheet 8
LVDSOUT_SPARE0_P [diffpair]: IC5.F2(IO_82) ; also sheet 8
LVDSOUT_TRIG_N [diffpair]: IC5.G3(IO_97) ; also sheet 8
LVDSOUT_TRIG_P [diffpair]: IC5.G4(IO_98) ; also sheet 8
LVDSOUT_TRIGB_N [diffpair]: IC5.F22(IO_96) ; also sheet 8
LVDSOUT_TRIGB_P [diffpair]: IC5.F21(IO_95) ; also sheet 8
MSEL0: IC5.M17(MSEL0) ; also sheet 8
MSEL1: IC5.L18(MSEL1) ; also sheet 8
MSEL2: IC5.L17(MSEL2) ; also sheet 8
MSEL3: IC5.K20(MSEL3) ; also sheet 8
NCE: IC5.L3(NCE) ; also sheet 8
NCONFIG: IC5.K5(NCONFIG) ; also sheet 8
NCSO: IC5.E2(IO_65) ; also sheet 8
NSTATUS: IC5.K6(NSTATUS) ; also sheet 8
ORA0: IC5.C2(IO_38) ; also sheet 6
ORA1: IC5.C1(IO_37) ; also sheet 6
ORB0: IC5.B2(IO_18) ; also sheet 6
ORB1: IC5.B1(IO_17) ; also sheet 6
OSC_CLK_IN: IC5.B11(CLK11) ; also sheet 8
RESET_IN: IC5.D10(IO_56) ; also sheet 8
SCLK3: IC5.E10(IO_72) ; also sheet 2,4,5,6,15
SCS3_ADC: IC5.F8(IO_84) ; also sheet 6
SCS3_CLK: IC5.G11(IO_104) ; also sheet 5
SCS3_IN1: IC5.G7(IO_100) ; also sheet 2
SCS3_IN1DAC: IC5.G9(IO_102) ; also sheet 2
SCS3_IN2: IC5.G8(IO_101) ; also sheet 4
SCS3_SLOWADC: IC5.C10(IO_44) ; also sheet 15
SDI3: IC5.F7(IO_83) ; also sheet 2,4,5,6,15
SDO3_ADC: IC5.F10(IO_86) ; also sheet 6
SDO3_IN1: IC5.A10(IO_8) ; also sheet 2
SDO3_IN2: IC5.B9(IO_25) ; also sheet 4
SDO3_SLOWADC: IC5.E9(IO_71) ; also sheet 15
TCK: IC5.L2(TCK) ; also sheet 8
TDI: IC5.L5(TDI) ; also sheet 8
TDO: IC5.L4(TDO) ; also sheet 8
TMS: IC5.L1(TMS) ; also sheet 8
VCCA [power]: IC5.F18(VCCA2) IC5.G6(VCCA3) IC5.T6(VCCA1) IC5.U18(VCCA4) ; also sheet 14
VCCINT [power]: IC5.G12(VCCINT_1) IC5.H9(VCCINT_2) IC5.J10(VCCINT_3) IC5.J11(VCCINT_4) IC5.J12(VCCINT_5) IC5.J13(VCCINT_6) IC5.J14(VCCINT_7) IC5.J16(VCCINT_8) IC5.K9(VCCINT_9) IC5.K14(VCCINT_10) IC5.K15(VCCINT_11) IC5.L9(VCCINT_12) IC5.L14(VCCINT_13) IC5.L16(VCCINT_14) IC5.M9(VCCINT_15) IC5.M14(VCCINT_16) IC5.M15(VCCINT_17) IC5.N9(VCCINT_18) IC5.N14(VCCINT_19) IC5.P9(VCCINT_20) IC5.P10(VCCINT_21) IC5.P11(VCCINT_22) IC5.P12(VCCINT_23) IC5.P13(VCCINT_24) IC5.P14(VCCINT_25) IC5.R8(VCCINT_26) IC5.R10(VCCINT_27) IC5.R12(VCCINT_28) ; also sheet 14
VCCIO2V5 [power]: IC5.A21(VCCIO7_1) IC5.AA6(VCCIO3_4) IC5.AB2(VCCIO3_5) IC5.AB21(VCCIO4_5) IC5.D4(VCCIO1_1) IC5.D12(VCCIO7_2) IC5.D14(VCCIO7_3) IC5.D16(VCCIO7_4) IC5.D18(VCCIO7_5) IC5.E19(VCCIO6_1) IC5.F4(VCCIO1_2) IC5.G19(VCCIO6_2) IC5.H4(VCCIO1_3) IC5.J20(VCCIO6_3) IC5.K4(VCCIO1_4) IC5.L19(VCCIO6_4) IC5.N4(VCCIO2_1) IC5.P18(VCCIO5_1) IC5.R4(VCCIO2_2) IC5.T19(VCCIO5_2) IC5.U4(VCCIO2_3) IC5.V19(VCCIO5_3) IC5.W4(VCCIO2_4) IC5.W5(VCCIO3_1) IC5.W9(VCCIO3_2) IC5.W11(VCCIO3_3) IC5.W12(VCCIO4_1) IC5.W16(VCCIO4_2) IC5.W18(VCCIO4_3) IC5.Y14(VCCIO4_4) IC5.Y19(VCCIO5_4) ; also sheet 10,14
VCCIO3V3 [power]: IC5.A2(VCCIO8_1) IC5.D5(VCCIO8_2) IC5.D9(VCCIO8_3) IC5.D11(VCCIO8_4) IC5.E8(VCCIO8_5) ; also sheet 14
VCCPLL [power]: IC5.E17(VCCD_PLL2) IC5.F6(VCCD_PLL3) IC5.U6(VCCD_PLL1) IC5.V17(VCCD_PLL4) ; also sheet 14
Unconnected: IC5.A4(IO_2) IC5.AA1(IO_282) IC5.AA3(IO_283) IC5.AA4(IO_284) IC5.AA11(CLK15) IC5.AA12(CLK13) IC5.AA18(IO_295) IC5.AA19(IO_296) IC5.AA21(IO_298) IC5.AB3(IO_299) IC5.AB4(IO_300) IC5.AB11(CLK14) IC5.AB12(CLK12) IC5.AB18(IO_311) IC5.AB19(IO_312) IC5.B5(IO_21) IC5.B6(IO_22) IC5.B10(IO_26) IC5.B12(CLK9) IC5.B21(IO_35) IC5.B22(IO_36) IC5.C19(IO_48) IC5.C20(IO_49) IC5.C21(IO_50) IC5.C22(IO_51) IC5.D2(IO_53) IC5.D6(IO_54) IC5.D19(IO_60) IC5.D20(IO_61) IC5.E1(IO_64) IC5.E3(IO_66) IC5.E4(IO_67) IC5.E7(IO_70) IC5.E11(IO_73) IC5.E13(IO_75) IC5.F9(IO_85) IC5.F11(IO_87) IC5.F15(IO_90) IC5.F16(IO_91) IC5.F17(IO_92) IC5.F19(IO_93) IC5.F20(IO_94) IC5.G1(CLK1) IC5.G5(IO_99) IC5.G13(IO_105) IC5.G14(IO_106) IC5.G15(IO_107) IC5.G16(IO_108) IC5.G17(IO_109) IC5.G18(IO_110) IC5.H5(IO_113) IC5.H6(IO_114) IC5.H7(IO_115) IC5.H8(IO_116) IC5.H10(IO_117) IC5.H11(IO_118) IC5.H14(IO_119) IC5.H15(IO_120) IC5.H16(IO_121) IC5.H17(IO_122) IC5.H18(IO_123) IC5.H19(IO_124) IC5.H20(IO_125) IC5.J3(IO_130) IC5.J4(IO_131) IC5.J5(IO_132) IC5.J6(IO_133) IC5.J7(IO_134) IC5.J8(IO_135) IC5.J17(IO_136) IC5.J18(IO_137) IC5.K7(IO_141) IC5.K8(IO_142) IC5.K19(IO_145) IC5.L7(IO_149) IC5.L8(IO_150) IC5.M5(IO_157) IC5.M7(IO_159) IC5.M16(IO_161) IC5.N5(IO_168) IC5.N6(IO_169) IC5.N16(IO_172) IC5.P5(IO_183) IC5.P6(IO_184) IC5.P15(IO_186) IC5.P16(IO_187) IC5.P17(IO_188) IC5.P20(IO_189) IC5.R5(IO_194) IC5.R6(IO_195) IC5.R14(IO_197) IC5.R15(IO_198) IC5.R16(IO_199) IC5.R17(IO_200) IC5.R20(IO_203) IC5.T1(CLK3) IC5.T2(CLK2) IC5.T3(IO_206) IC5.T4(IO_207) IC5.T5(IO_208) IC5.T16(IO_218) IC5.T17(IO_219) IC5.T18(IO_220) IC5.T21(CLK6) IC5.T22(CLK7) IC5.U9(IO_225) IC5.U10(IO_226) IC5.U11(IO_227) IC5.U12(IO_228) IC5.U13(IO_229) IC5.V3(IO_240) IC5.V4(IO_241) IC5.V7(IO_244) IC5.V8(IO_245) IC5.V9(IO_246) IC5.V10(IO_247) IC5.V11(IO_248) IC5.V12(IO_249) IC5.V13(IO_250) IC5.V16(IO_253) IC5.W6(IO_258) IC5.W8(IO_260) IC5.W14(IO_263) IC5.W15(IO_264) IC5.W19(IO_266) IC5.W20(IO_267) IC5.Y3(IO_272) IC5.Y4(IO_273) IC5.Y6(IO_274) IC5.Y8(IO_276)

### Notes on the sheet
- GND for FPGA | Power for FPGA | Config and clocks for FPGA | Inputs and outputs for the FPGA | Inputs and outputs for the FPGA
- FPGA and IOs